# EasyEDA schematic ReA4091_Rev4_2023-05-15_SCH.json

## Sheets
1 Overview: REV: Commodore; Capture By: DATE
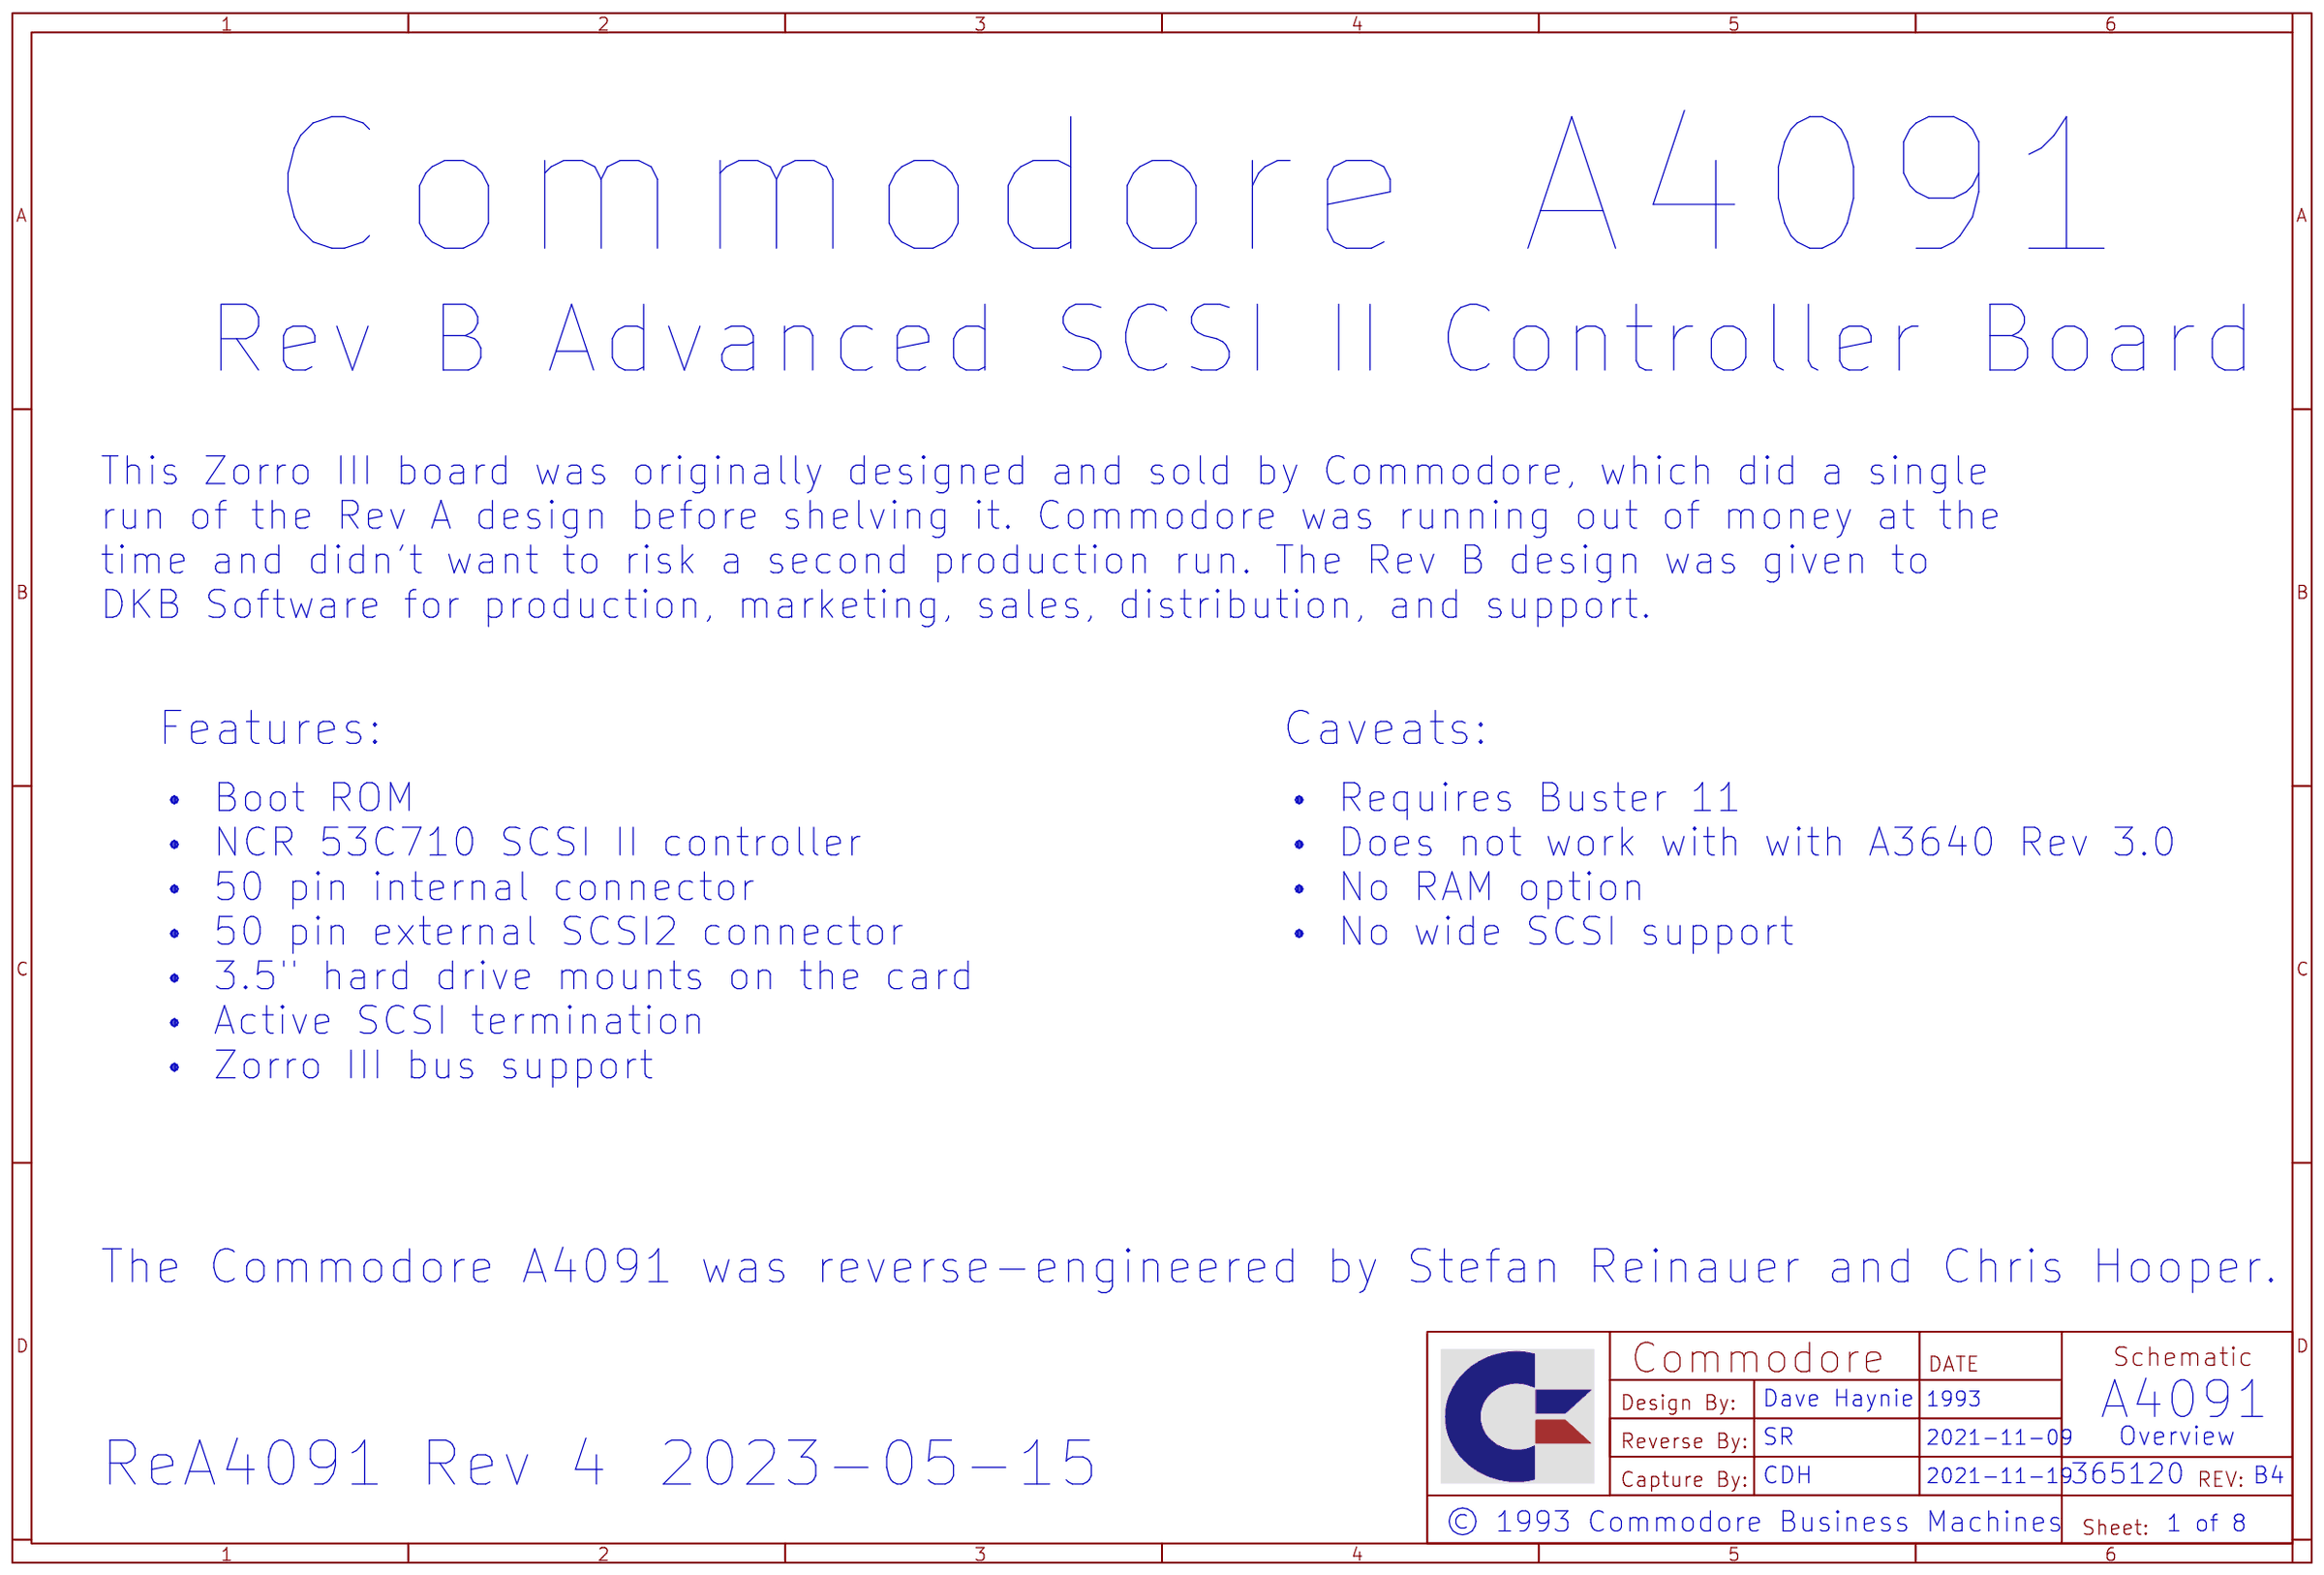
[diagram p0: Overview]
2 SCSI
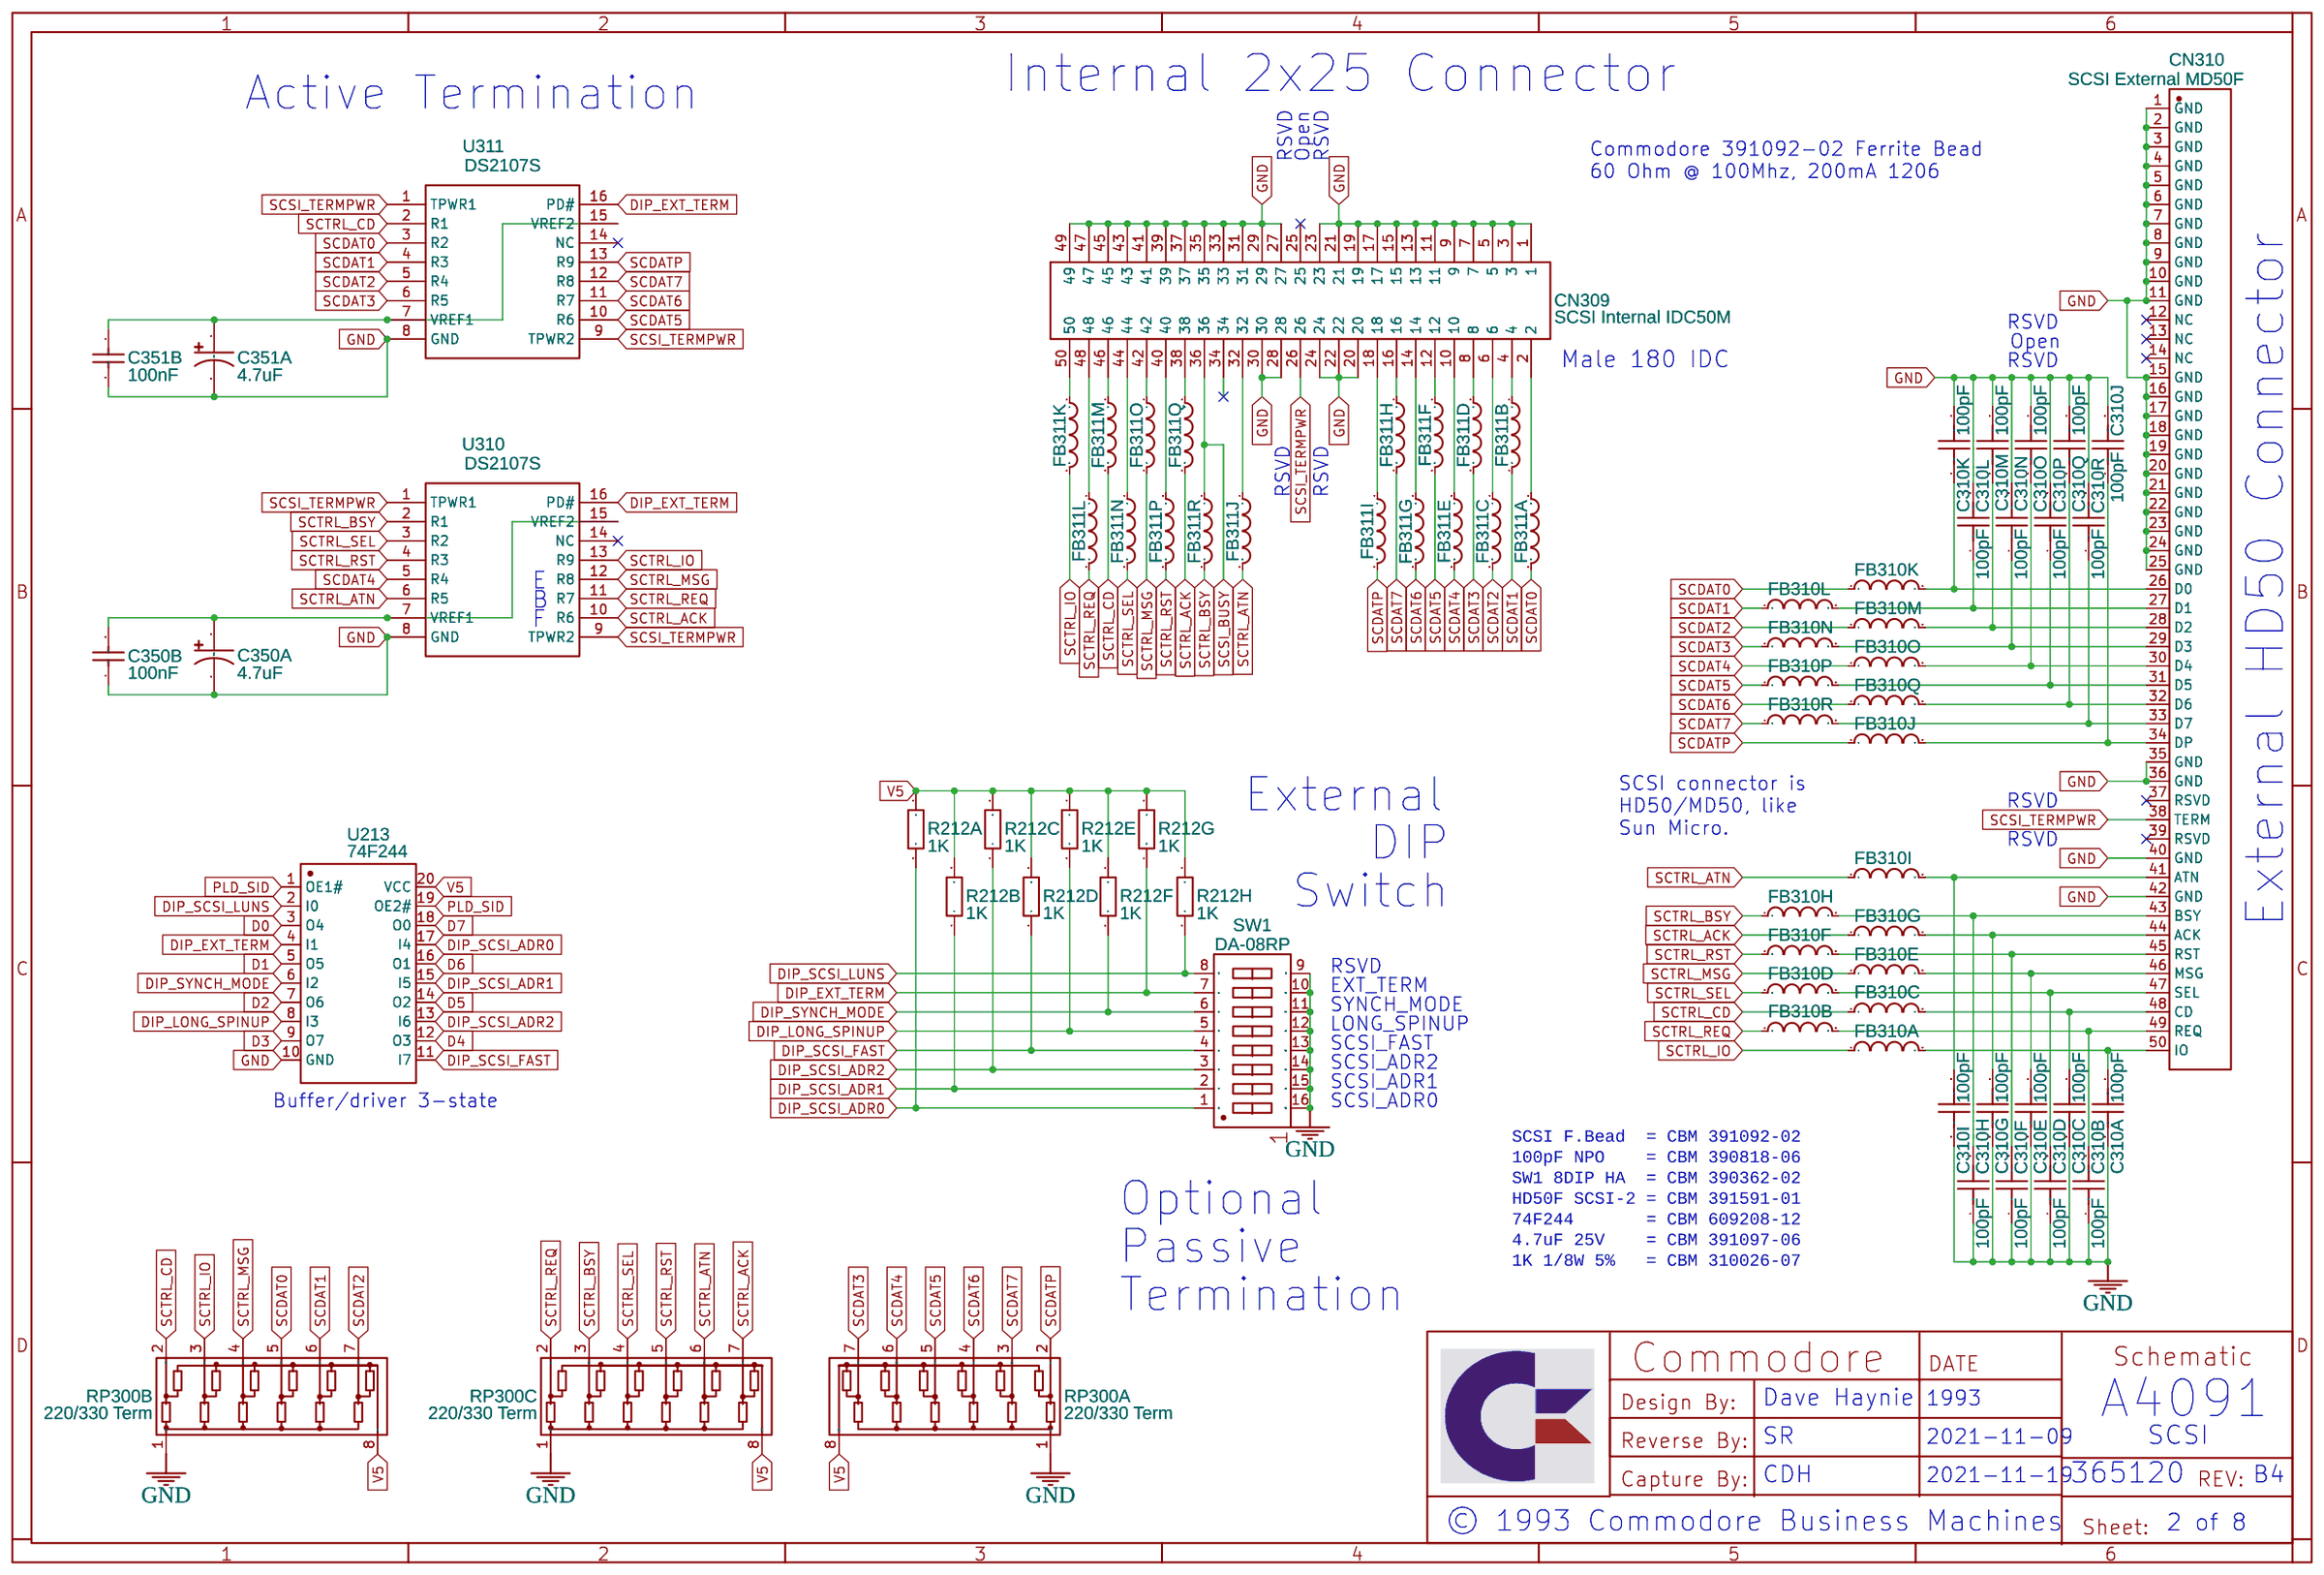
[diagram p1: SCSI]
3 NCR53C710
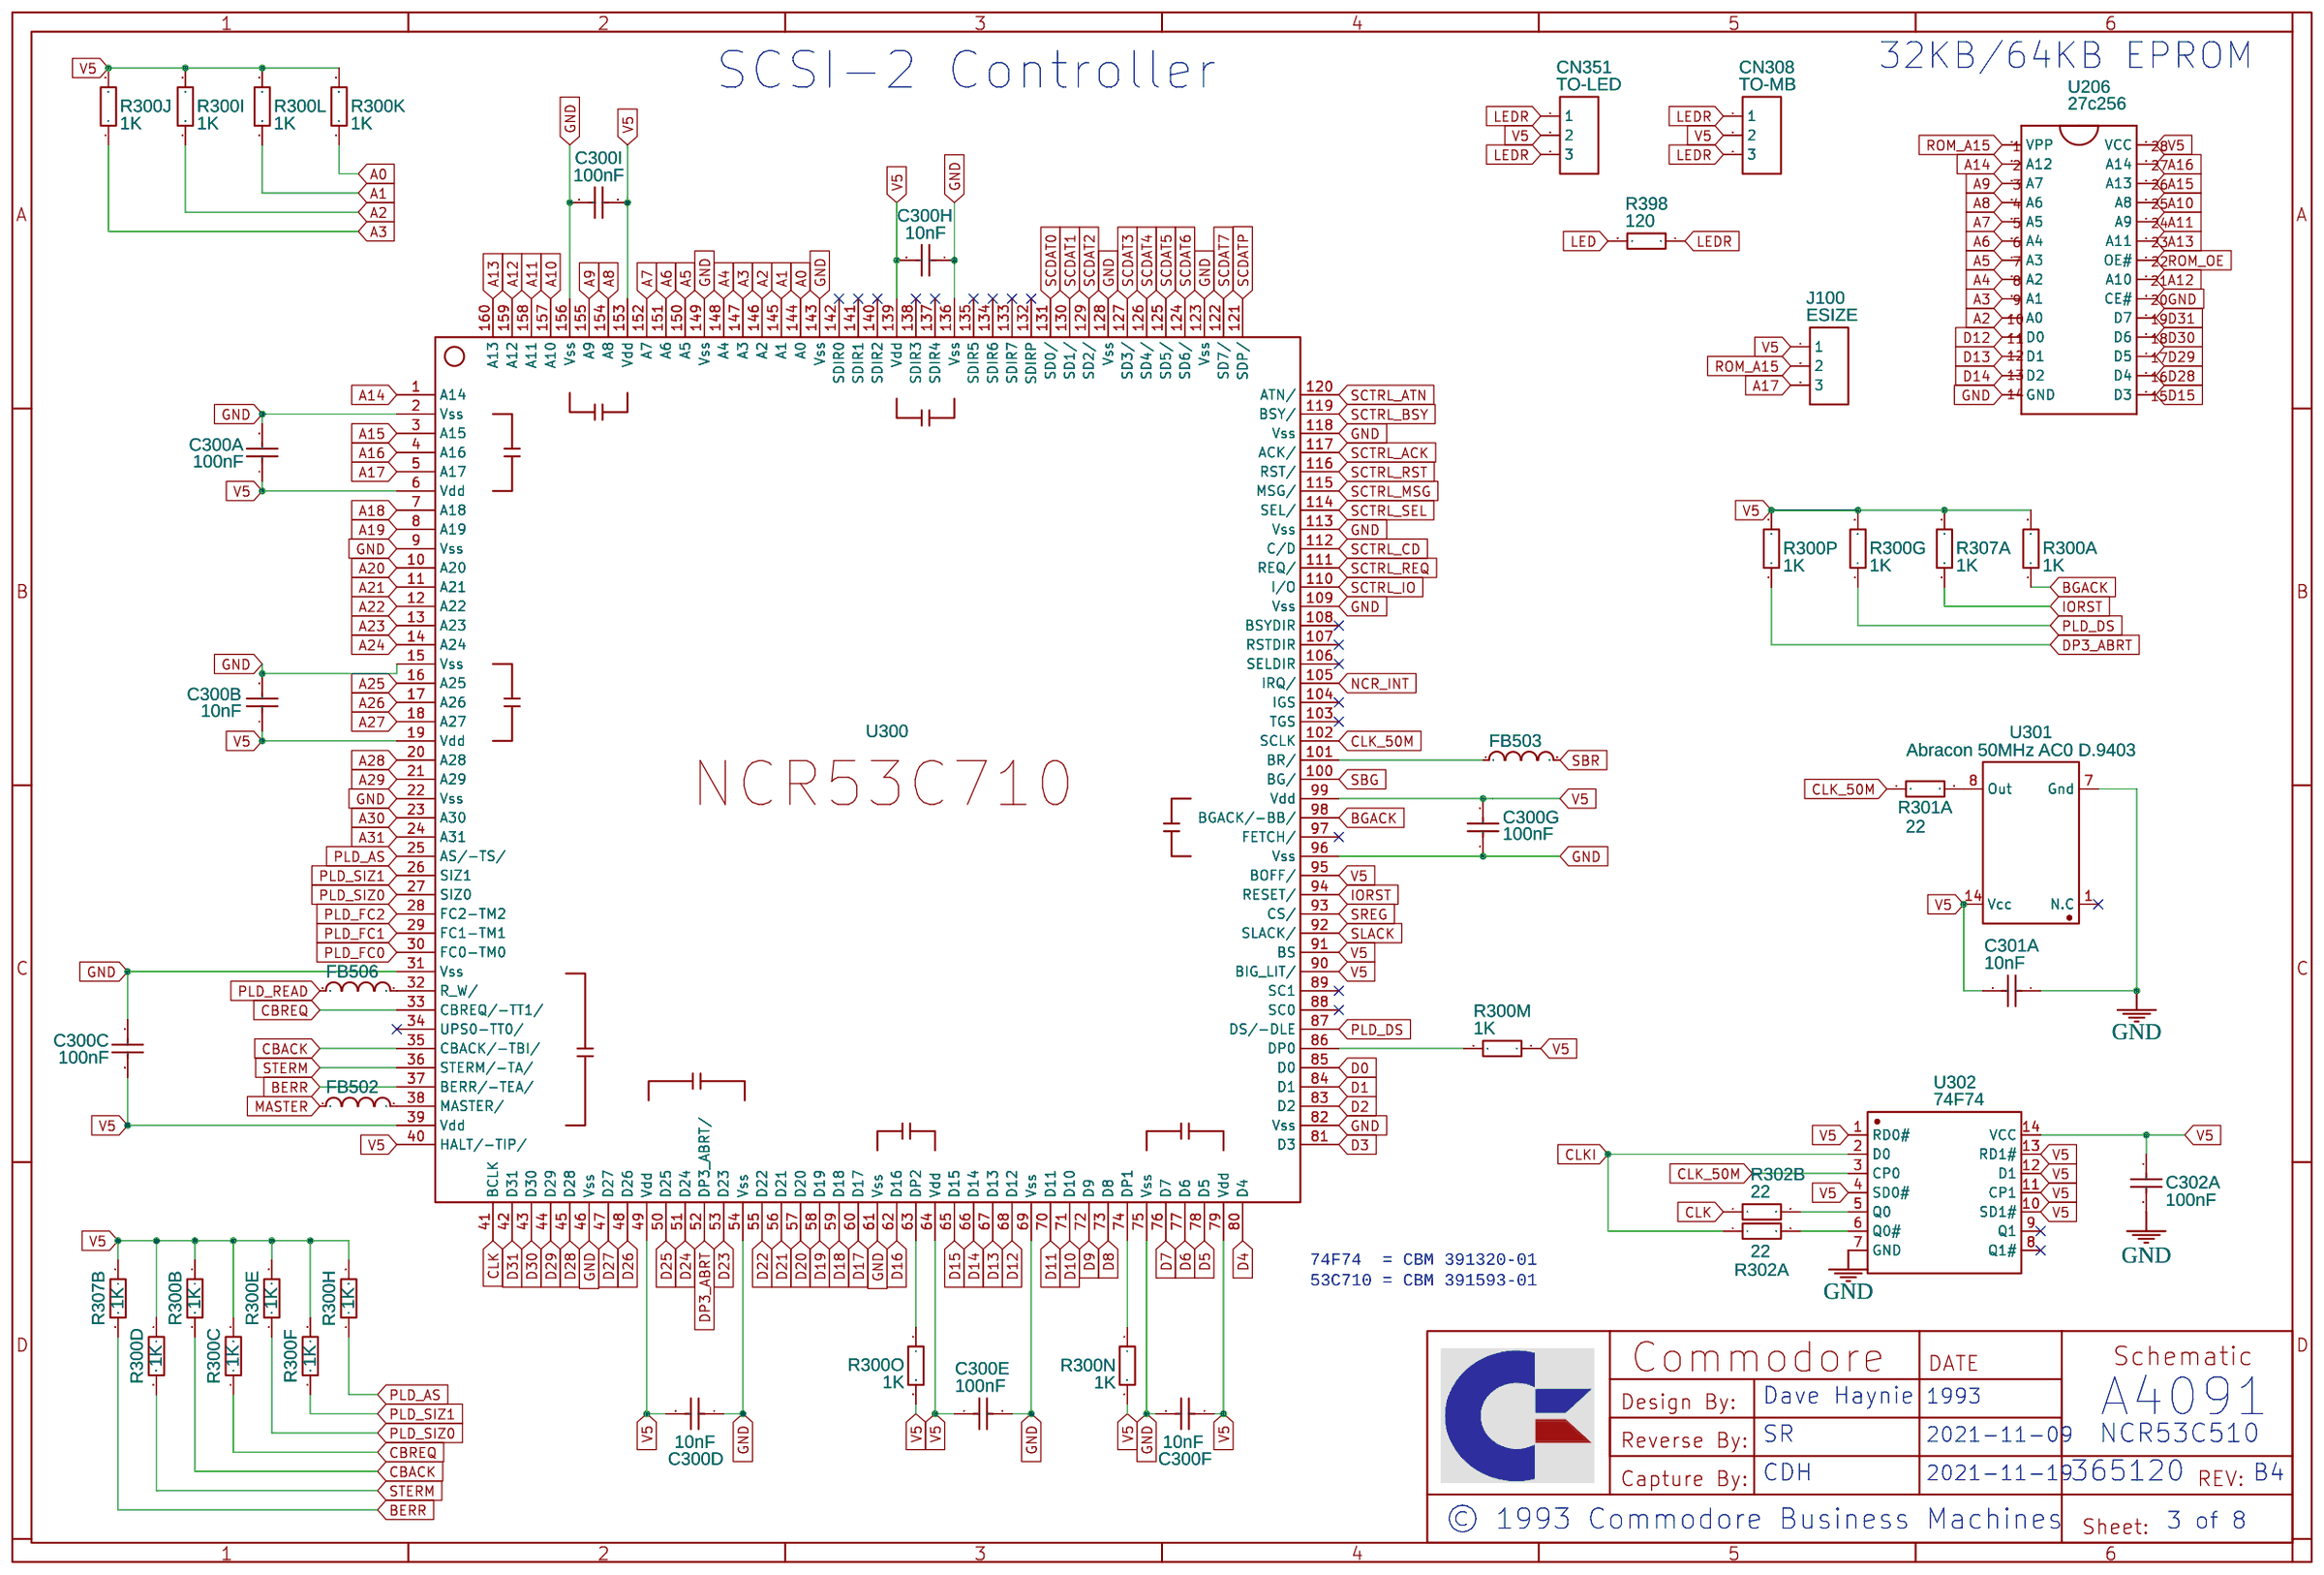
[diagram p2: NCR53C710]
4 PLD Symbols
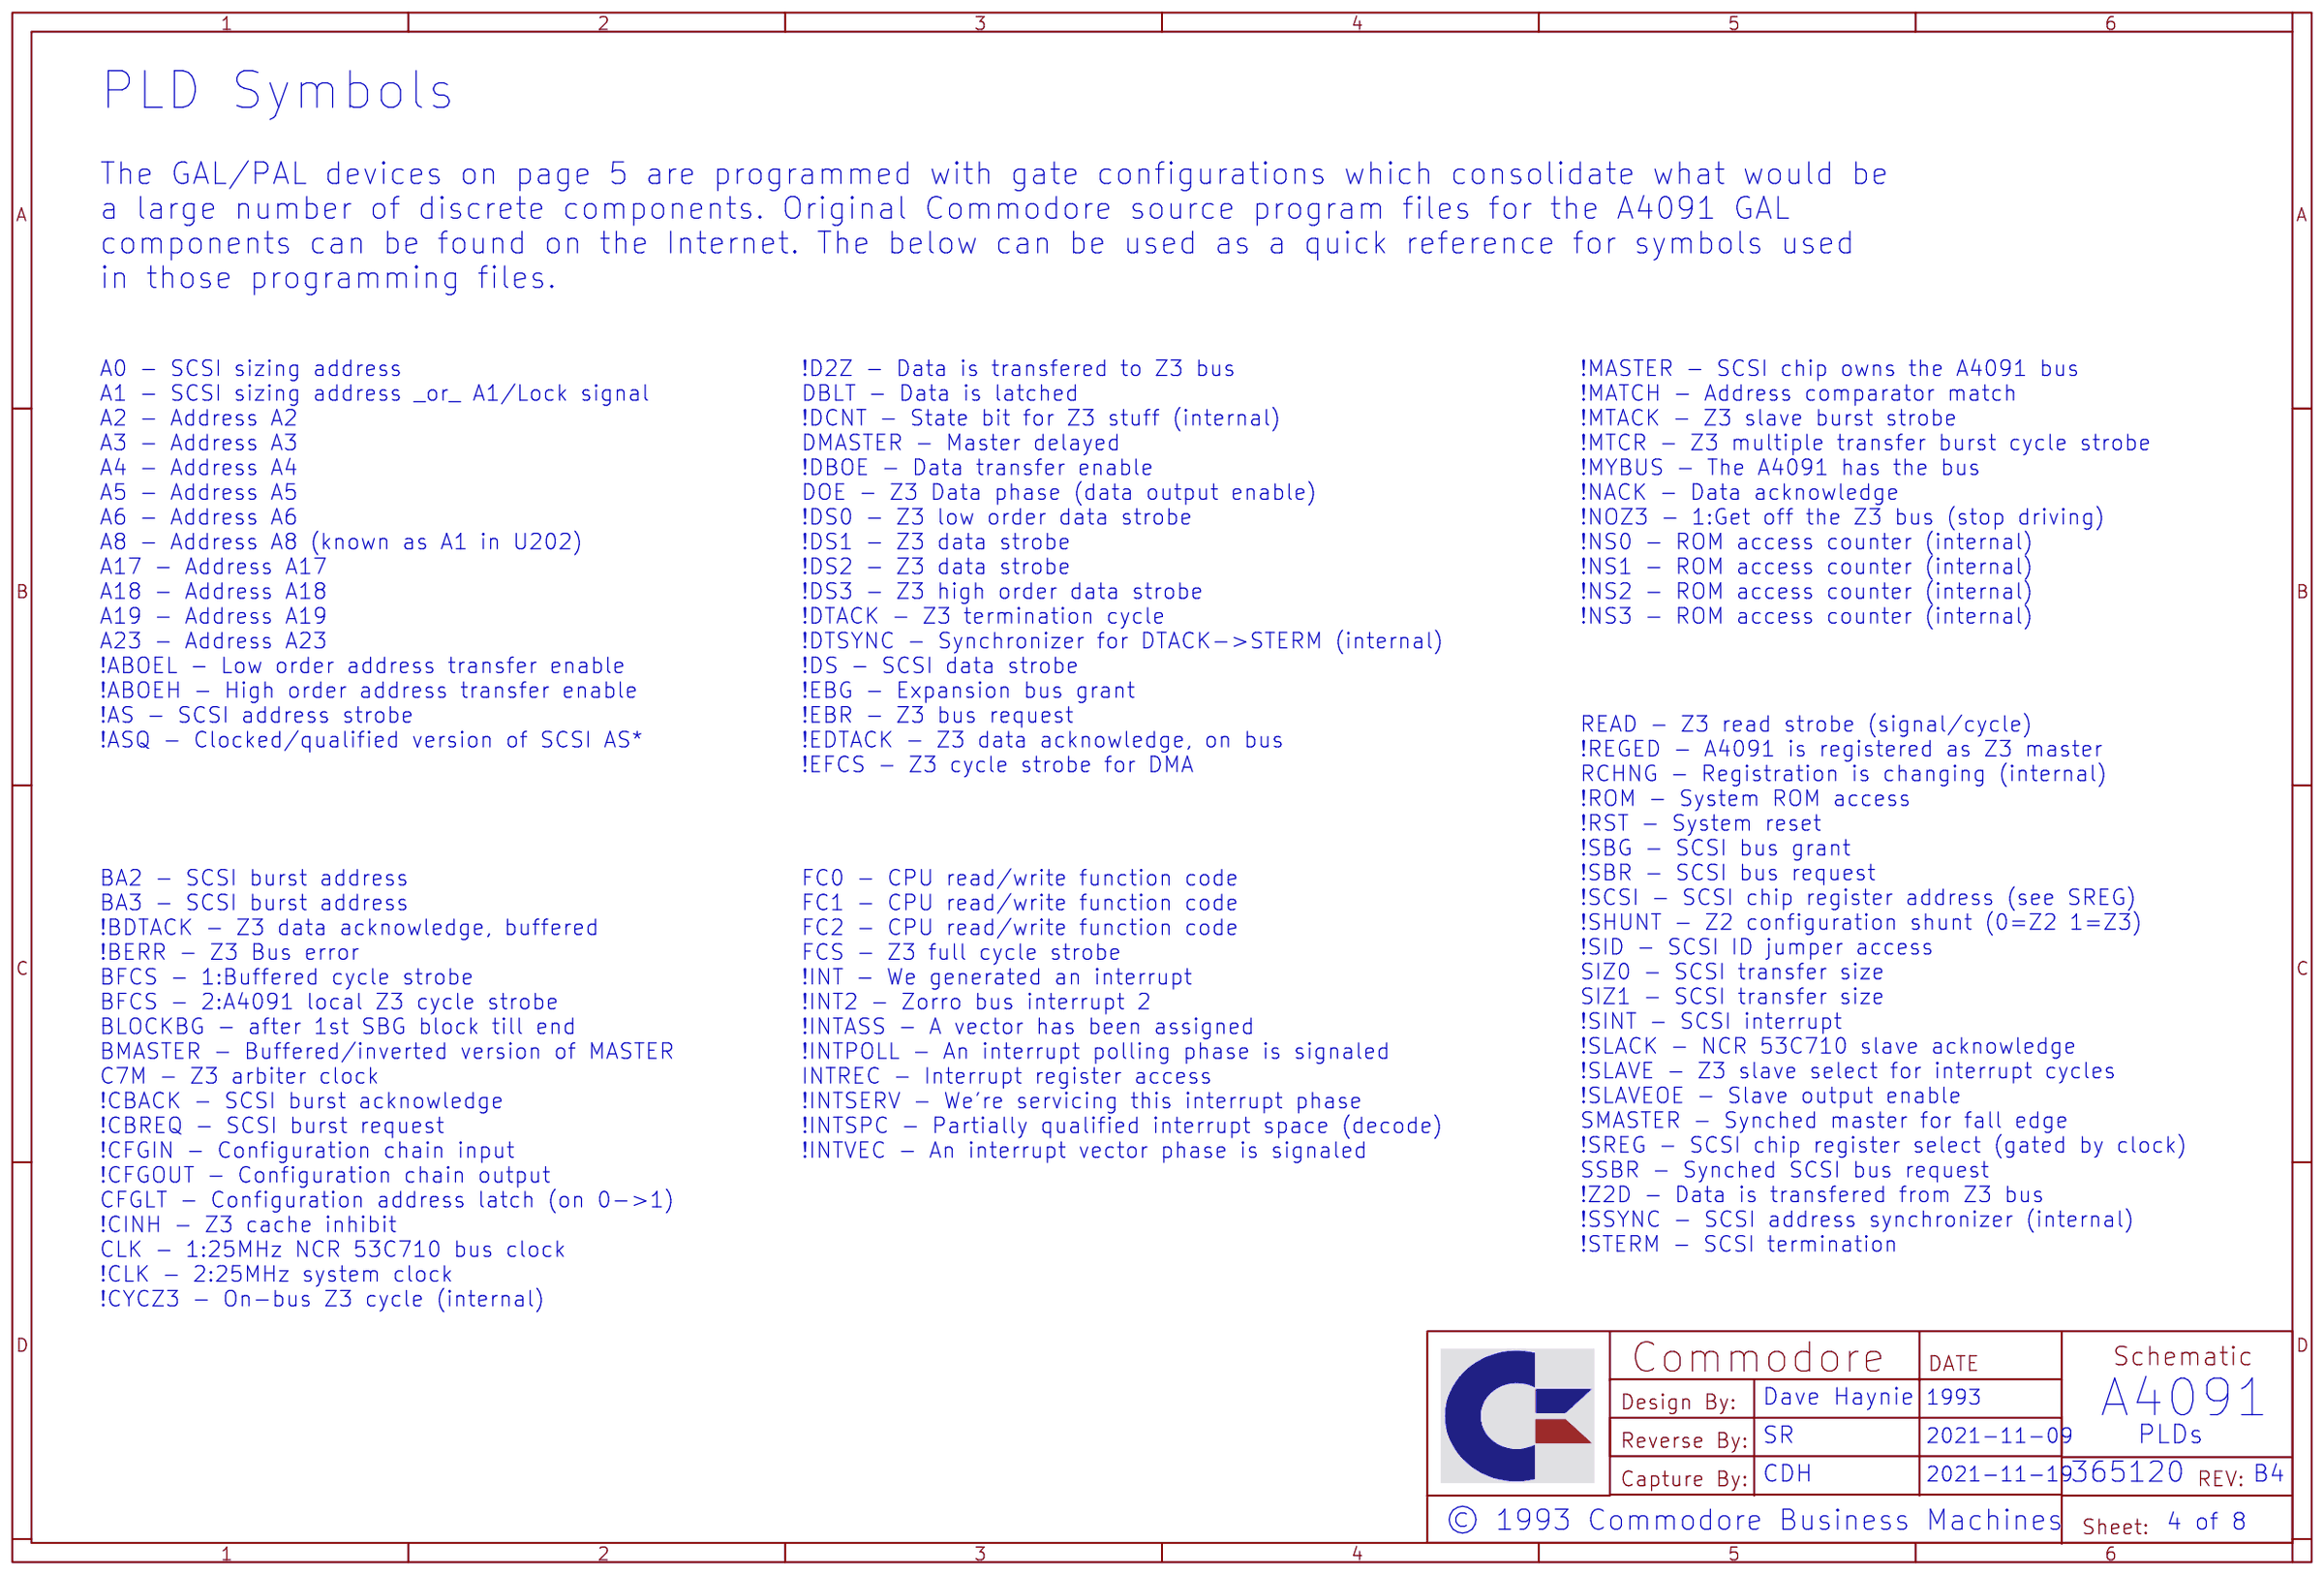
[diagram p3: PLD Symbols]
5 PLDs
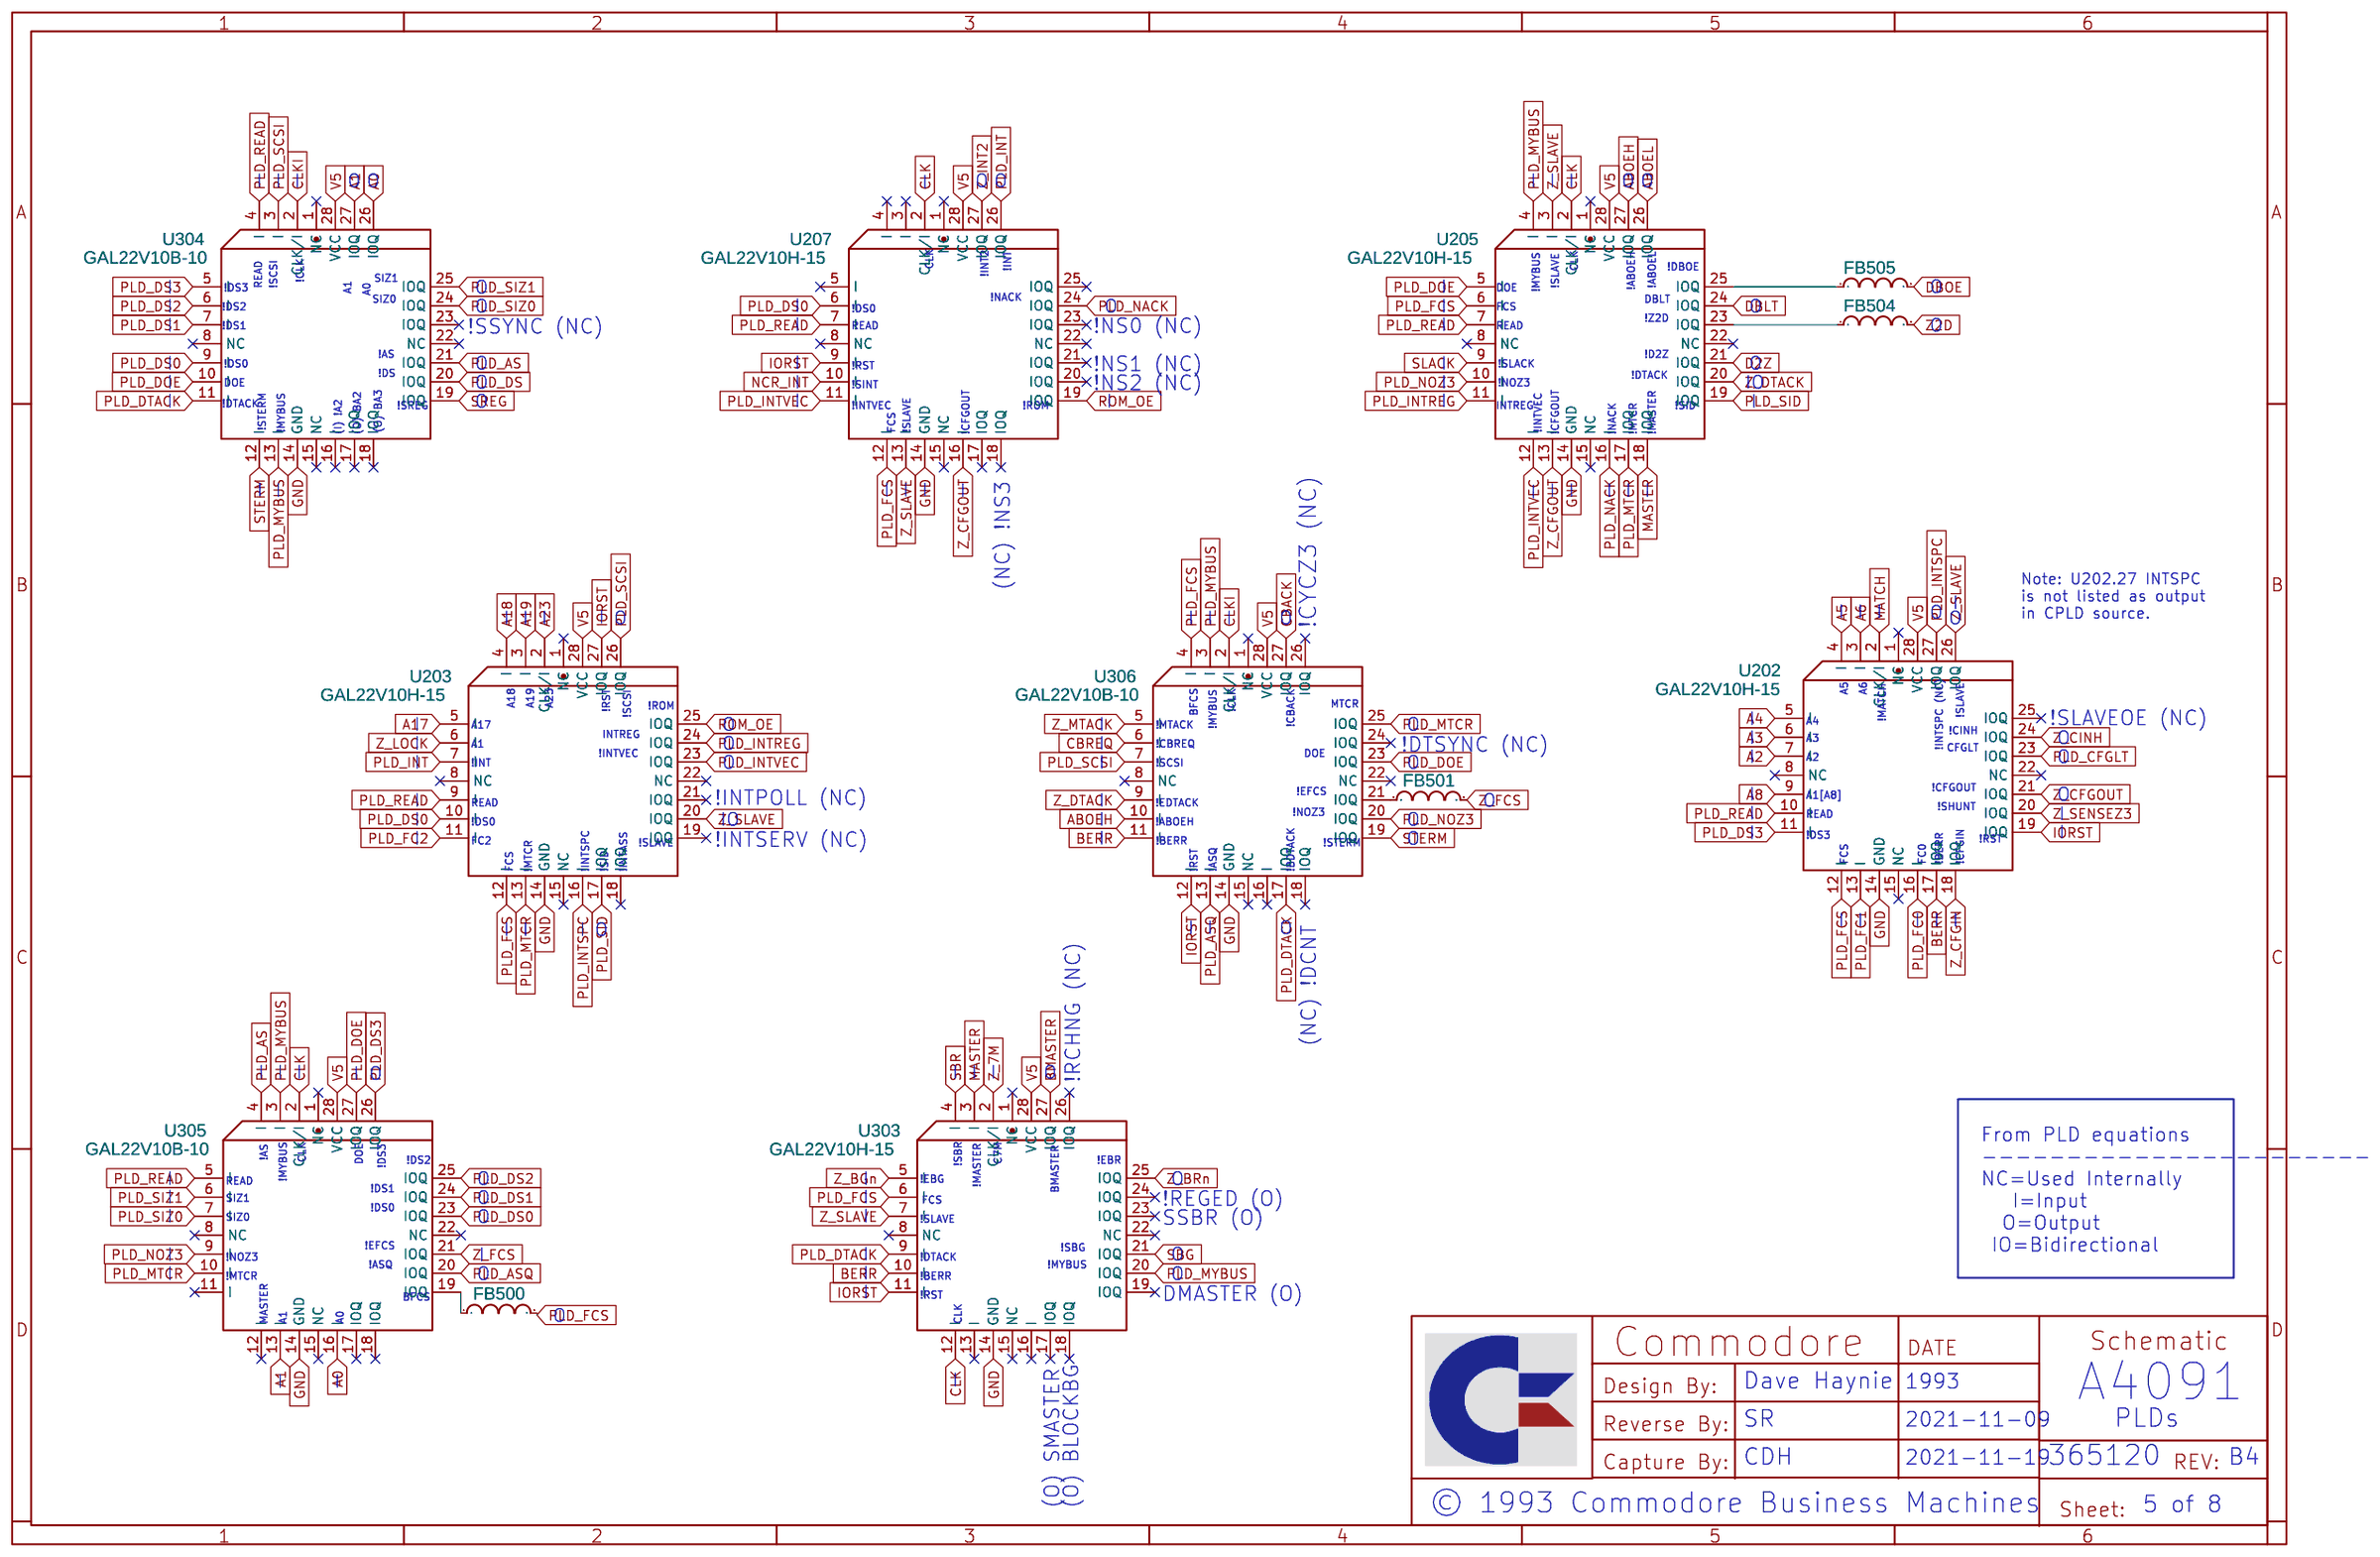
[diagram p4: PLDs]
6 Zorro
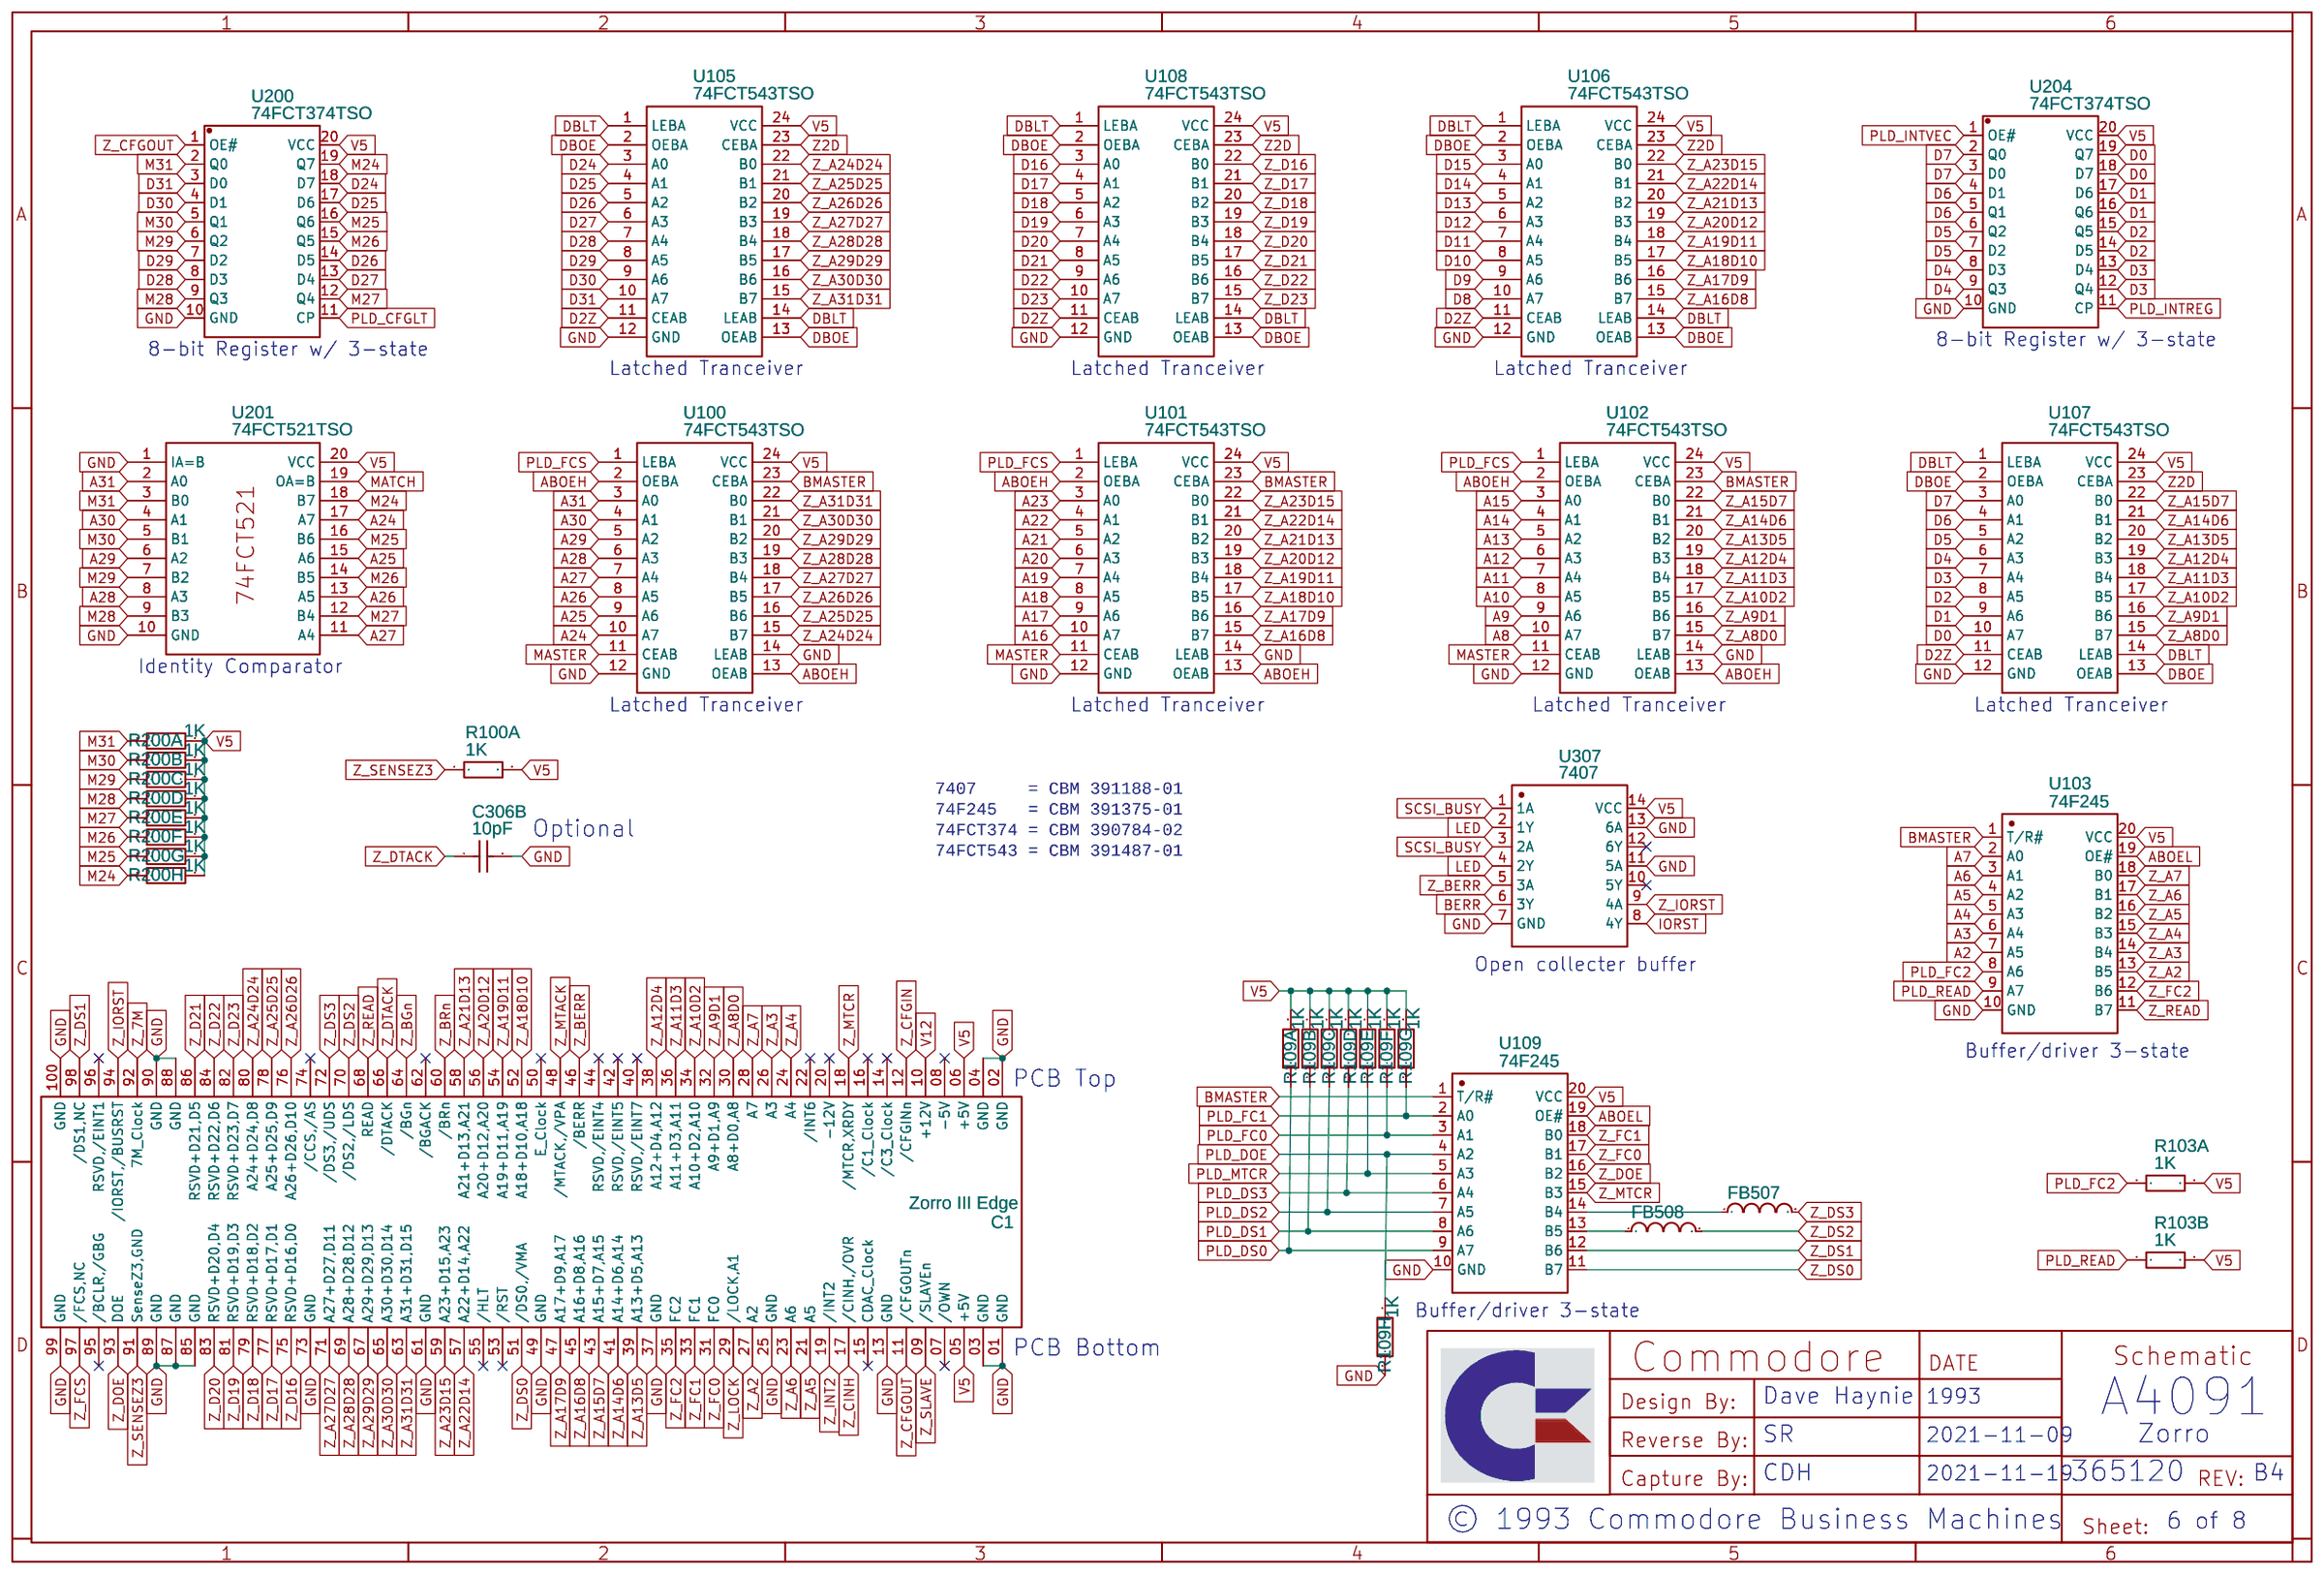
[diagram p5: Zorro]
7 Power
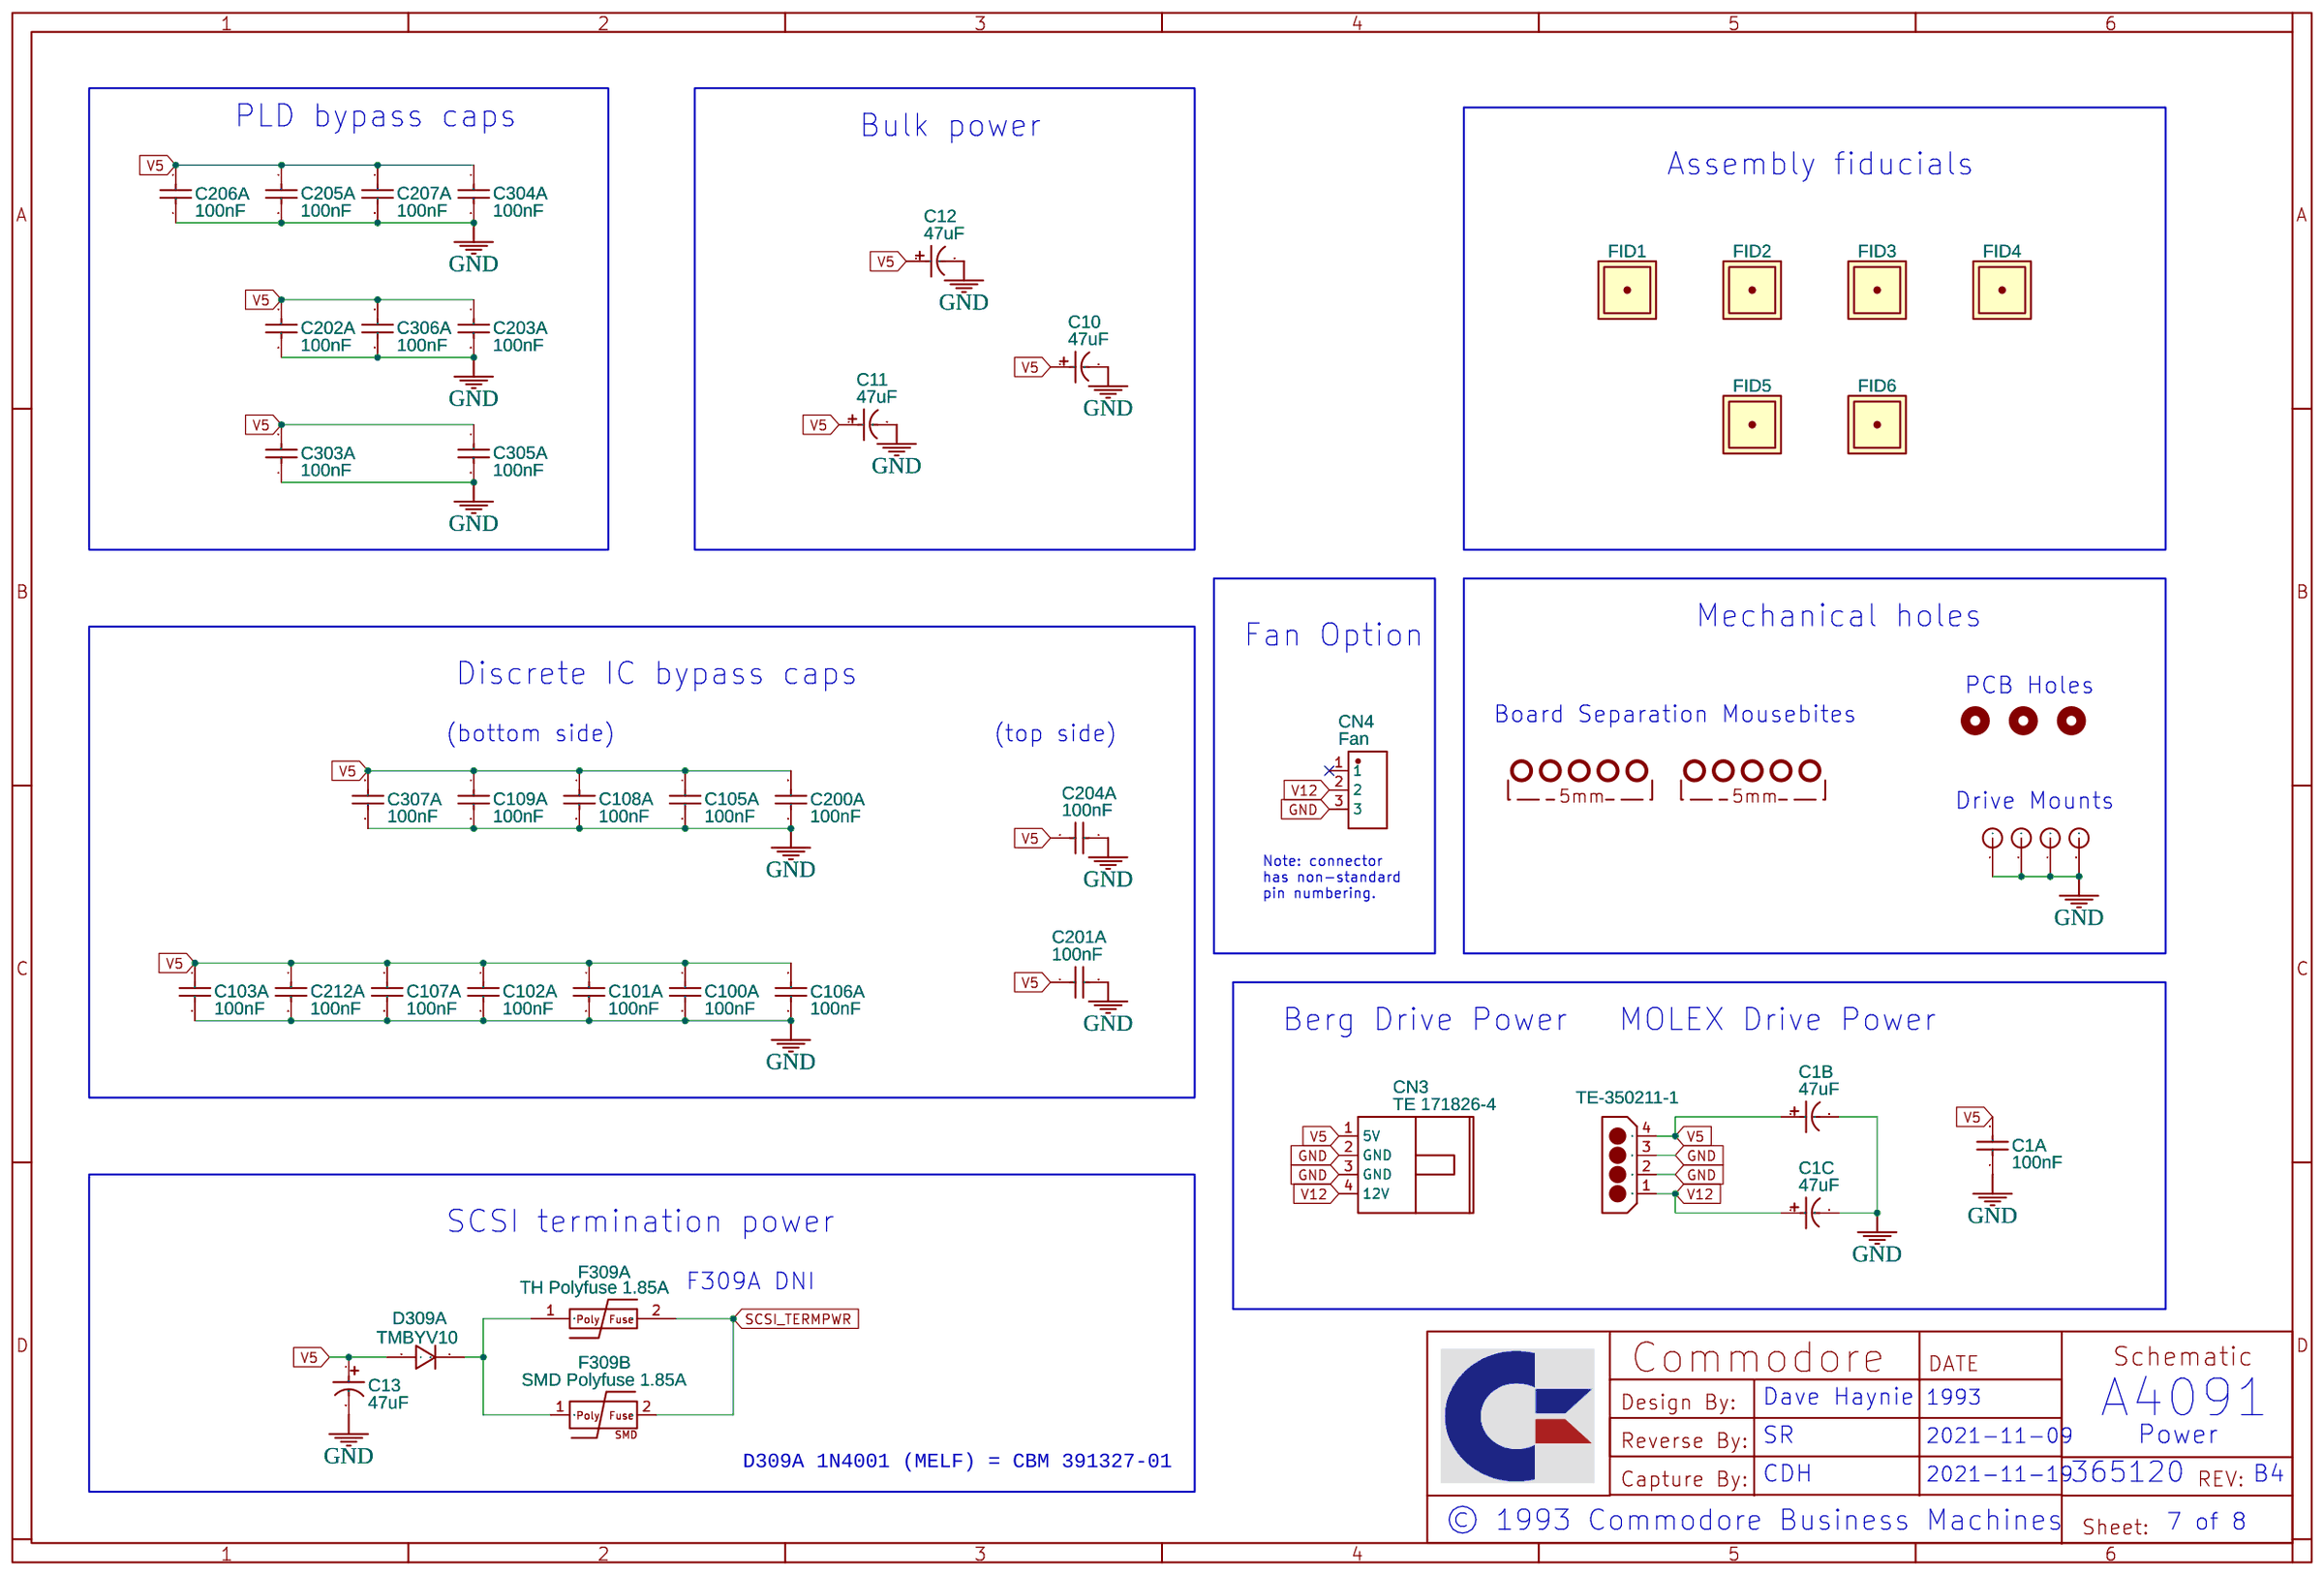
[diagram p6: Power]
8 SCSI Term
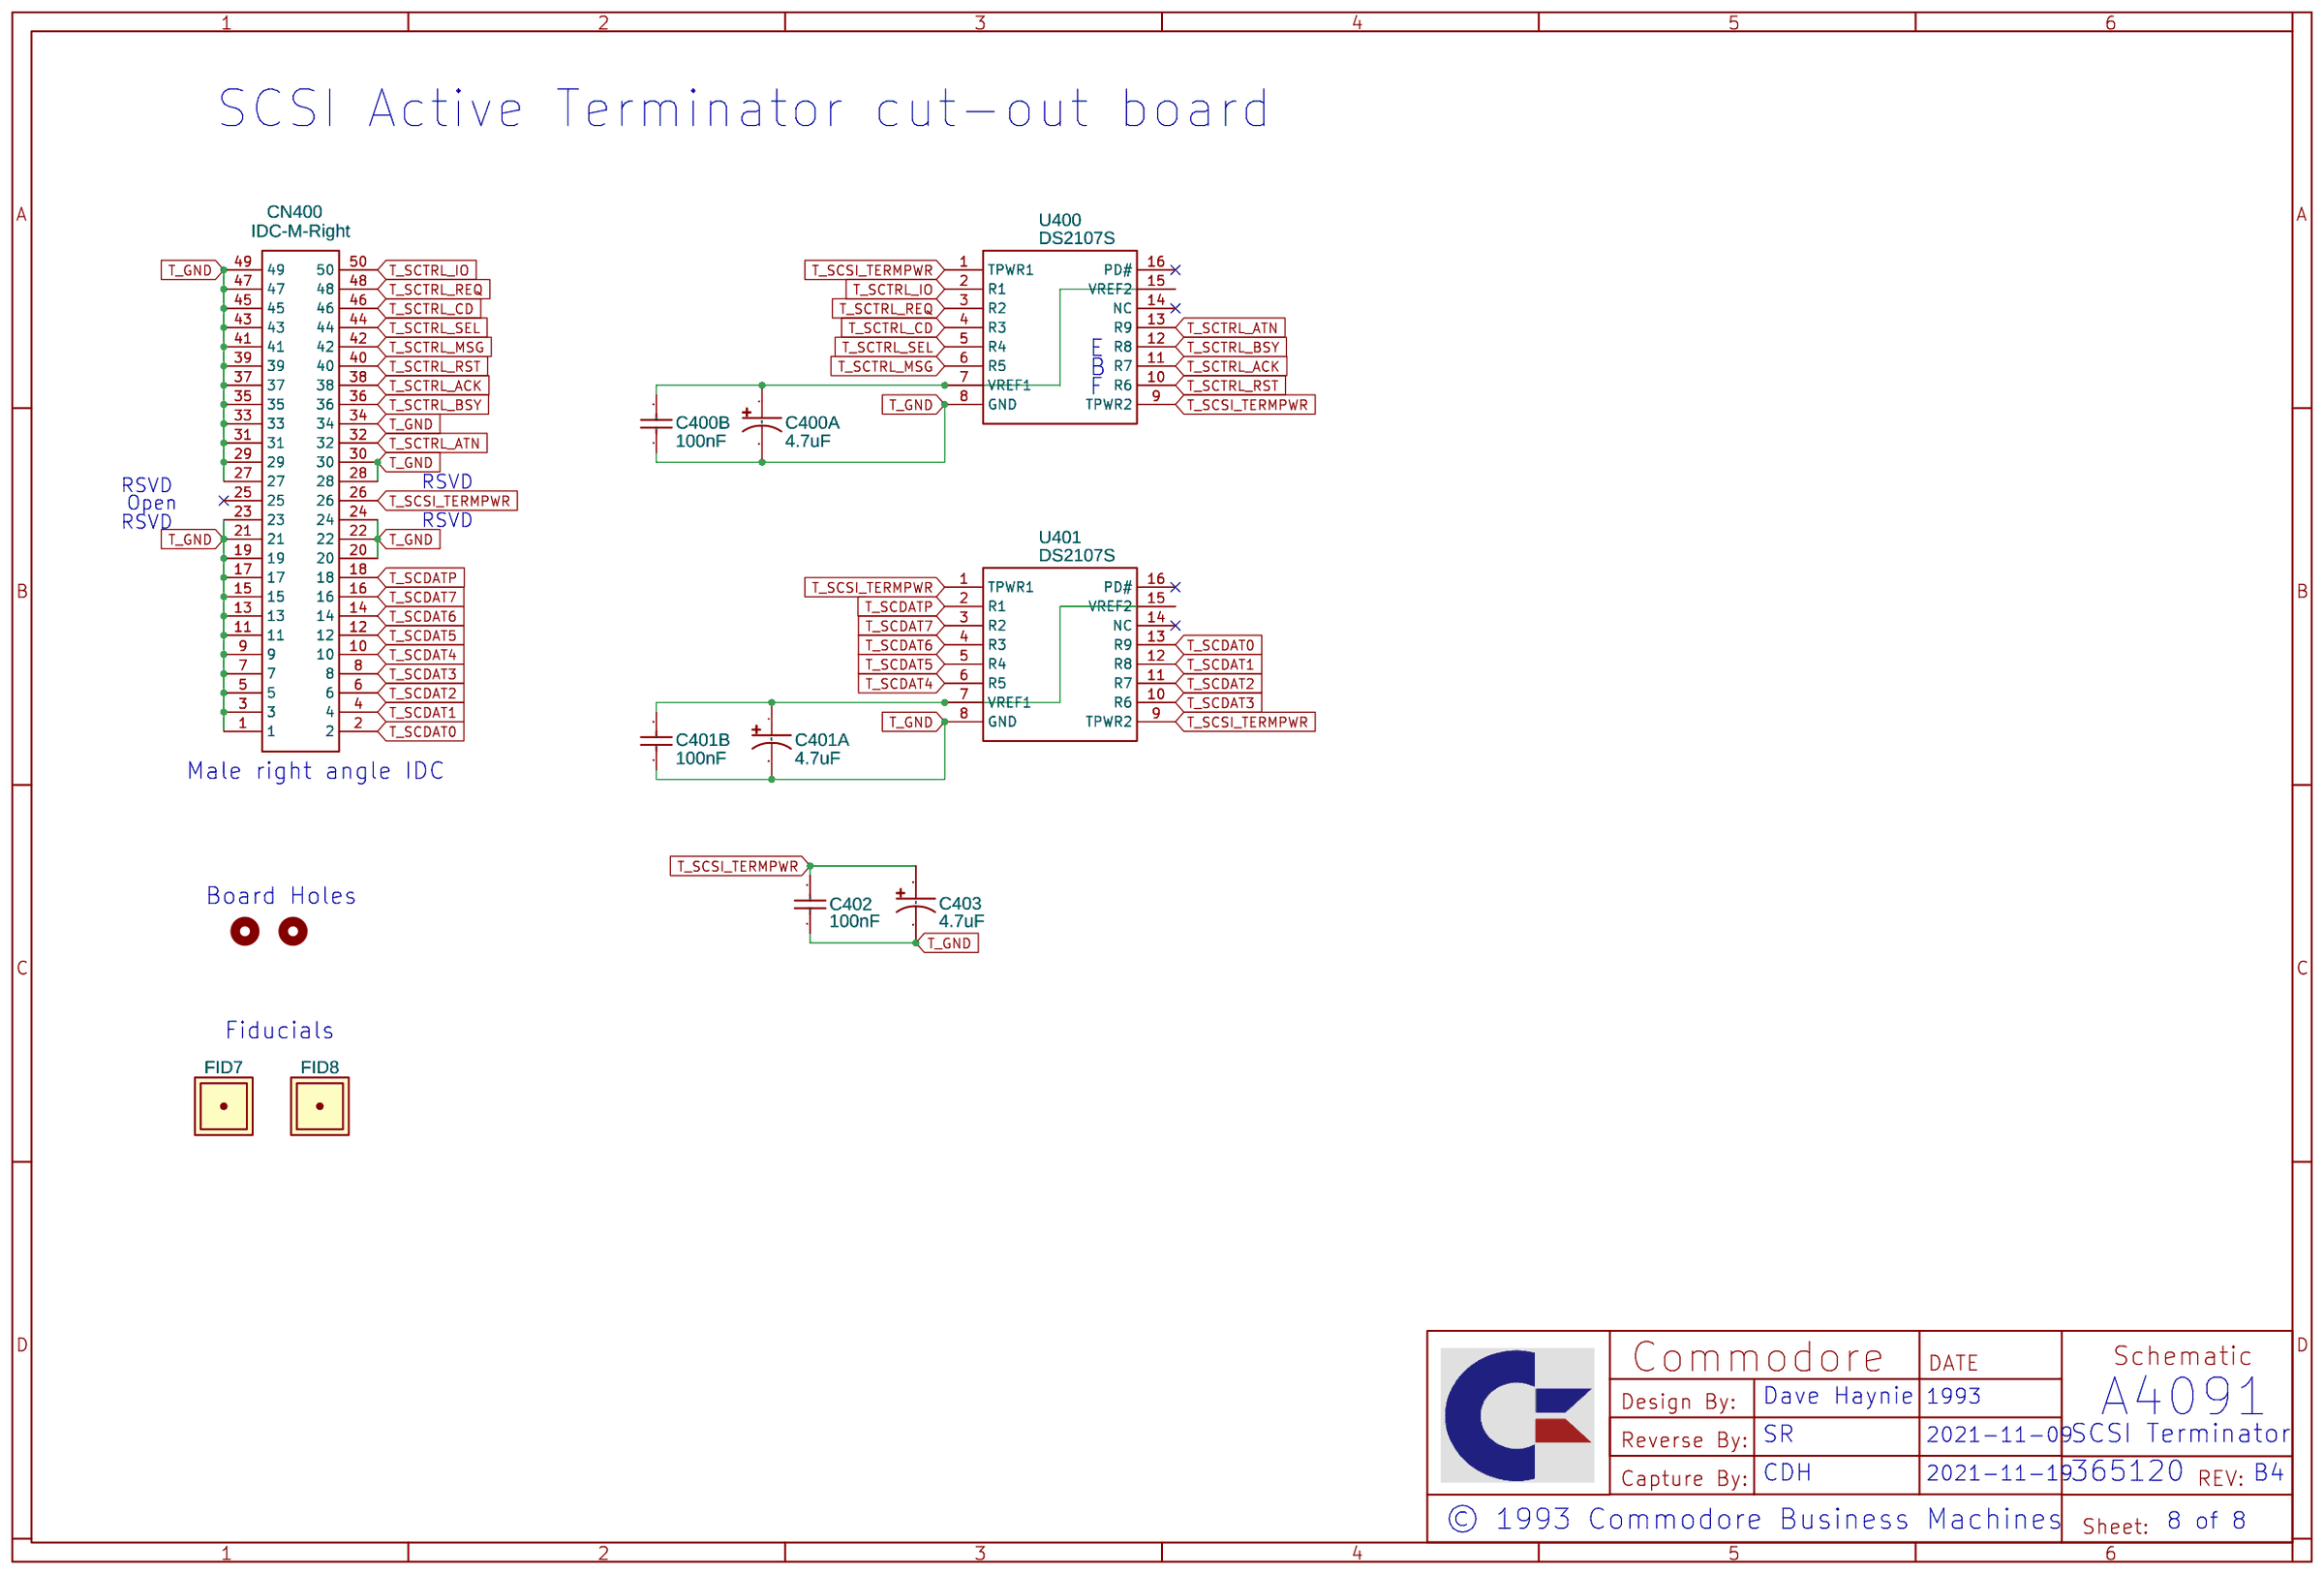
[diagram p7: SCSI Term]

## Parts
sheet NCR53C710
C300A  100nF  [C1206]
C300B  10nF  [C1206]
C300C  100nF  [C1206]
C300D  10nF  [C1206]
C300E  100nF  [C1206]
C300F  10nF  [C1206]
C300G  100nF  [C1206]
C300H  10nF  [C1206]
C300I  100nF  [C1206]
C301A  10nF  [C1206]
C302A  100nF  [C1206]
CN308  TO-MB  [HDR-TH_3P-P2.54-V-M-1]
CN351  TO-LED  [HDR-TH_3P-P2.54-V-M-1]
FB502  60Ω  [L1206]
FB503  60Ω  [L1206]
FB506  60Ω  [L1206]
J100  ESIZE  [HDR-TH_3P-P2.54-V-M-1]
R300A  1K  [C1206]
R300B  1K  [C1206]
R300C  1K  [C1206]
R300D  1K  [C1206]
R300E  1K  [C1206]
R300F  1K  [C1206]
R300G  1K  [C1206]
R300H  1K  [C1206]
R300I  1K  [C1206]
R300J  1K  [C1206]
R300K  1K  [C1206]
R300L  1K  [C1206]
R300M  1K  [C1206]
R300N  1K  [C1206]
R300O  1K  [C1206]
R300P  1K  [C1206]
R301A  22  [C1206]
R302A  22  [C1206]
R302B  22  [C1206]
R307A  1K  [C1206]
R307B  1K  [C1206]
R398  120  [C1206]
U206  27c256  [DIP-28W]
U300  NCR53C710  [PQFP-160-PASTE]
U301  Abracon 50MHz AC0 D.9403  [OSC-TH_4P-L20.4-W12.8-P15.24-BL]
U302  74F74  [SOIC-14_L8.7-W3.9-P1.27-LS6.0-BL]
sheet PLDs
FB500  60Ω  [L1206]
FB501  60Ω  [L1206]
FB504  60Ω  [L1206]
FB505  60Ω  [L1206]
U202  GAL22V10H-15  [PLCC-28_TOP_L11.5-W11.5-P1.27-LS12.5-L_HOLES]
U203  GAL22V10H-15  [PLCC-28_TOP_L11.5-W11.5-P1.27-LS12.5-L_HOLES]
U205  GAL22V10H-15  [PLCC-28_TOP_L11.5-W11.5-P1.27-LS12.5-L_HOLES]
U207  GAL22V10H-15  [PLCC-28_TOP_L11.5-W11.5-P1.27-LS12.5-L_HOLES]
U303  GAL22V10H-15  [PLCC-28_TOP_L11.5-W11.5-P1.27-LS12.5-L_HOLES]
U304  GAL22V10B-10  [PLCC-28_TOP_L11.5-W11.5-P1.27-LS12.5-L_HOLES]
U305  GAL22V10B-10  [PLCC-28_TOP_L11.5-W11.5-P1.27-LS12.5-L_HOLES]
U306  GAL22V10B-10  [PLCC-28_TOP_L11.5-W11.5-P1.27-LS12.5-L_HOLES]
sheet Power
C1A  100nF  [C1206]
C1B  47uF  [CAP-SMD_BD6.3-L6.6-W6.6-FD_PASTE]
C1C  47uF  [CAP-SMD_BD6.3-L6.6-W6.6-FD_PASTE]
C10  47uF  [CAP-SMD_BD6.3-L6.6-W6.6-FD_PASTE]
C11  47uF  [CAP-SMD_BD6.3-L6.6-W6.6-FD_PASTE]
C12  47uF  [CAP-SMD_BD6.3-L6.6-W6.6-FD_PASTE]
C13  47uF  [CAP-SMD_BD6.3-L6.6-W6.6-FD_PASTE]
C100A  100nF  [C1206]
C101A  100nF  [C1206]
C102A  100nF  [C1206]
C103A  100nF  [C1206]
C105A  100nF  [C1206]
C106A  100nF  [C1206]
C107A  100nF  [C1206]
C108A  100nF  [C1206]
C109A  100nF  [C1206]
C200A  100nF  [C1206]
C201A  100nF  [C1206]
C202A  100nF  [C1206]
C203A  100nF  [C1206]
C204A  100nF  [C1206]
C205A  100nF  [C1206]
C206A  100nF  [C1206]
C207A  100nF  [C1206]
C212A  100nF  [C1206]
C303A  100nF  [C1206]
C304A  100nF  [C1206]
C305A  100nF  [C1206]
C306A  100nF  [C1206]
C307A  100nF  [C1206]
CN2  TE-350211-1  [TE-350211-1-SIMPLE]
CN3  TE 171826-4  [FLOPPY PWR]
CN4  Fan  [CONN-TH_KF2510-3AGW]
D309A  TMBYV10  [MELF_L5.0-W2.6-FD]
F309A  TH Polyfuse 1.85A  [FUSE-TH_BD3.1-L7.5-P25.00-D1.2]
F309B  SMD Polyfuse 1.85A  [FUSE-SMD-F2920]
FID1  FIDUCIAL_SQUARE_DOT_128_100  [FIDUCIAL_SQUARE_DOT_128_100]
FID2  FIDUCIAL_SQUARE_DOT_128_100  [FIDUCIAL_SQUARE_DOT_128_100]
FID3  FIDUCIAL_SQUARE_DOT_128_100  [FIDUCIAL_SQUARE_DOT_128_100]
FID4  FIDUCIAL_SQUARE_DOT_128_100  [FIDUCIAL_SQUARE_DOT_128_100]
FID5  FIDUCIAL_SQUARE_DOT_128_100  [FIDUCIAL_SQUARE_DOT_128_100]
FID6  FIDUCIAL_SQUARE_DOT_128_100  [FIDUCIAL_SQUARE_DOT_128_100]
MB1  Mousebites  [MOUSEBITES]
MB2  Mousebites  [MOUSEBITES]
MH1  MOUNTINGHOLE_4MM  [MOUNTINGHOLE_4MM_PAD]
MH2  MOUNTINGHOLE_4MM  [MOUNTINGHOLE_4MM_PAD]
MH3  MOUNTINGHOLE_4MM  [MOUNTINGHOLE_4MM_PAD]
MH4  MOUNTINGHOLE_4MM  [MOUNTINGHOLE_4MM_PAD]
MK5  Mounting_Hole  [MOUNTINGHOLE_5MM]
MK6  Mounting_Hole  [MOUNTINGHOLE_5MM]
MK7  Mounting_Hole  [MOUNTINGHOLE_5MM]
sheet SCSI Term
C400A  4.7uF  [CAP-SMD_BD4.0-L4.3-W4.3-LS5.1-FD-PASTE]
C400B  100nF  [C1206]
C401A  4.7uF  [CAP-SMD_BD4.0-L4.3-W4.3-LS5.1-FD-PASTE]
C401B  100nF  [C1206]
C402  100nF  [C1206]
C403  4.7uF  [CAP-SMD_BD4.0-L4.3-W4.3-LS5.1-FD-PASTE]
CN400  IDC-M-Right  [IDC-TH_50P-P2.54_Z-231012050106_SMALL_SILK]
FID7  FIDUCIAL_SQUARE_DOT_128_100  [FIDUCIAL_SQUARE_DOT_128_100]
FID8  FIDUCIAL_SQUARE_DOT_128_100  [FIDUCIAL_SQUARE_DOT_128_100]
MK1  Mounting_Hole  [MOUNTINGHOLE_5MM]
MK2  Mounting_Hole  [MOUNTINGHOLE_5MM]
U400  DS2107S  [SOIC16E]
U401  DS2107S  [SOIC16E]
sheet SCSI
C310A  100pF  [C1206]
C310B  100pF  [C1206]
C310C  100pF  [C1206]
C310D  100pF  [C1206]
C310E  100pF  [C1206]
C310F  100pF  [C1206]
C310G  100pF  [C1206]
C310H  100pF  [C1206]
C310I  100pF  [C1206]
C310J  100pF  [C1206]
C310K  100pF  [C1206]
C310L  100pF  [C1206]
C310M  100pF  [C1206]
C310N  100pF  [C1206]
C310O  100pF  [C1206]
C310P  100pF  [C1206]
C310Q  100pF  [C1206]
C310R  100pF  [C1206]
C350A  4.7uF  [CAP-SMD_BD4.0-L4.3-W4.3-LS5.1-FD-PASTE]
C350B  100nF  [C1206]
C351A  4.7uF  [CAP-SMD_BD4.0-L4.3-W4.3-LS5.1-FD-PASTE]
C351B  100nF  [C1206]
CN309  SCSI Internal IDC50M  [IDC-TH_300S-50P]
CN310  SCSI External MD50F  [MD50 RIGHT ANGLE CONNECTOR]
FB310A  60Ω  [L1206]
FB310B  60Ω  [L1206]
FB310C  60Ω  [L1206]
FB310D  60Ω  [L1206]
FB310E  60Ω  [L1206]
FB310F  60Ω  [L1206]
FB310G  60Ω  [L1206]
FB310H  60Ω  [L1206]
FB310I  60Ω  [L1206]
FB310J  60Ω  [L1206]
FB310K  60Ω  [L1206]
FB310L  60Ω  [L1206]
FB310M  60Ω  [L1206]
FB310N  60Ω  [L1206]
FB310O  60Ω  [L1206]
FB310P  60Ω  [L1206]
FB310Q  60Ω  [L1206]
FB310R  60Ω  [L1206]
FB311A  60Ω  [L1206]
FB311B  60Ω  [L1206]
FB311C  60Ω  [L1206]
FB311D  60Ω  [L1206]
FB311E  60Ω  [L1206]
FB311F  60Ω  [L1206]
FB311G  60Ω  [L1206]
FB311H  60Ω  [L1206]
FB311I  60Ω  [L1206]
FB311J  60Ω  [L1206]
FB311K  60Ω  [L1206]
FB311L  60Ω  [L1206]
FB311M  60Ω  [L1206]
FB311N  60Ω  [L1206]
FB311O  60Ω  [L1206]
FB311P  60Ω  [L1206]
FB311Q  60Ω  [L1206]
FB311R  60Ω  [L1206]
R212A  1K  [C1206]
R212B  1K  [C1206]
R212C  1K  [C1206]
R212D  1K  [C1206]
R212E  1K  [C1206]
R212F  1K  [C1206]
R212G  1K  [C1206]
R212H  1K  [C1206]
RP300A  220/330 Term  [R_ARRAY_SIP8]
RP300B  220/330 Term  [R_ARRAY_SIP8]
RP300C  220/330 Term  [R_ARRAY_SIP8]
SW1  DA-08RP  [SW-TH_DA-08]
U213  74F244  [SOIC-20_L13.0-W7.6-P1.27-LS10.3-BL]
U310  DS2107S  [SOIC16E]
U311  DS2107S  [SOIC16E]
sheet Zorro
C1  Zorro III Edge  [ZORRO III EDGE]
C306B  10pF  [C0805]
FB507  60Ω  [L1206]
FB508  60Ω  [L1206]
R100A  1K  [C1206]
R103A  1K  [C1206]
R103B  1K  [C1206]
R109A  1K  [C1206]
R109B  1K  [C1206]
R109C  1K  [C1206]
R109D  1K  [C1206]
R109E  1K  [C1206]
R109F  1K  [C1206]
R109G  1K  [C1206]
R109H  1K  [C1206]
R200A  1K  [C1206]
R200B  1K  [C1206]
R200C  1K  [C1206]
R200D  1K  [C1206]
R200E  1K  [C1206]
R200F  1K  [C1206]
R200G  1K  [C1206]
R200H  1K  [C1206]
U100  74FCT543TSO  [SOIC24E]
U101  74FCT543TSO  [SOIC24E]
U102  74FCT543TSO  [SOIC24E]
U103  74F245  [SOIC-20_L13.0-W7.6-P1.27-LS10.3-BL]
U105  74FCT543TSO  [SOIC24E]
U106  74FCT543TSO  [SOIC24E]
U107  74FCT543TSO  [SOIC24E]
U108  74FCT543TSO  [SOIC24E]
U109  74F245  [SOIC-20_L13.0-W7.6-P1.27-LS10.3-BL]
U200  74FCT374TSO  [SOIC-20_L13.0-W7.6-P1.27-LS10.3-BL]
U201  74FCT521TSO  [SOIC-20_L13.0-W7.6-P1.27-LS10.3-BL]
U204  74FCT374TSO  [SOIC-20_L13.0-W7.6-P1.27-LS10.3-BL]
U307  7407  [SOIC-14_L8.7-W3.9-P1.27-LS6.0-BL]

## Library data of the parts
C1A C100A C101A C102A C103A C105A C106A C107A C108A C109A C200A C201A C202A C203A C204A C205A C206A C207A C212A C300A C300C C300E C300G C300I C302A C303A C304A C305A C306A C307A C350B C351B C400B C401B C402 = CL31B104KBCNNNC: Supplier: LCSC; Manufacturer: SAMSUNG; Supplier Part: C24497; JLCPCB Part Class: Basic Part
C300B C300D C300F C300H C301A = 1206B103K500NT: Supplier: LCSC; Manufacturer: FH; Supplier Part: C1846; JLCPCB Part Class: Basic Part
CN308 CN351 J100 = Header-Male-2.54_1x3: Supplier: LCSC; Manufacturer: BOOMELE; Manufacturer Part: Header2.54mm 1*3P; Supplier Part: C49257; JLCPCB Part Class: Extended Part
FB500-FB508 = MLB3216-601(f): Supplier: LCSC; Manufacturer: FH; Manufacturer Part: CBG321609U600T; Supplier Part: C1020; JLCPCB Part Class: Extended Part
R100A R103A R103B R109A R109B R109C R109D R109E R109F R109G R109H R200A R200B R200C R200D R200E R200F R200G R200H R212A R212B R212C R212D R212E R212F R212G R212H R300A R300B R300C R300D R300E R300F R300G R300H R300I R300J R300K R300L R300M R300N R300O R300P R307A R307B = 1206W4F1001T5E: Supplier: LCSC; Manufacturer: UniOhm; Supplier Part: C4410; JLCPCB Part Class: Basic Part
R301A R302A R302B = RS-06K22R0FT: Supplier: LCSC; Manufacturer: UNI-ROYAL(厚声); Manufacturer Part: 1206W4F220JT5E; Contributor: LCSC; Supplier Part: C17958; JLCPCB Part Class: Basic Part
R398 = RTT061200FTP: Supplier: LCSC; Manufacturer: UNI-ROYAL(厚声); Manufacturer Part: 1206W4F1200T5E; Contributor: LCSC; Supplier Part: C17909; JLCPCB Part Class: Extended Part
U206 = 27c256: Manufacturer: XFCN(兴飞); Manufacturer Part: IC254V-12-28-0743-P1524; Supplier Part: C2874016; Supplier: LCSC; Contributor: cdhooper
U300 = NCR53C710: Contributor: cdhooper
U301 = Osc: Supplier Part: C1138655; Supplier: LCSC; Contributor: tcollings; Manufacturer Part: MXO45T-3C-50M000000; Package Display: No; Manufacturer: CTS(西迪斯)
U302 = 74F74D: Supplier: LCSC; Manufacturer: PHILIPS; Supplier Part: C5573; Supplier Part Alt: C6805
U202 U203 U205 U207 U303-U306 = GAL22V10: Manufacturer: Lattice; Manufacturer Part: GAL220V10; Contributor: cdhooper
C1B C1C C10 C12 C13 = RVT1V470M0605: Supplier: LCSC; Manufacturer: HONOR; Supplier Part: C3344
C11 = RVT1V470M0605: Supplier: LCSC; Manufacturer: HONOR; Supplier Part: C3344; JLCPCB Part Class: Extended Part
CN2 = TE-350211-1-Simple: Supplier: Digi-Key; Supplier Part: AN1212-ND; Manufacturer: TE Connectivity; Manufacturer Part: 350211-1; Contributor: cdhooper; link: https://www.digikey.com/product-detail/en/te-connectivity-amp-connectors/350211-1/A1212-ND/30127
CN3 = FLOPPY PWR TE 171826-4: Manufacturer Part: 171826-4; Supplier Part: A112643-ND; Supplier: Digi-Key; Contributor: cdhooper; Manufacturer: TE Connectivity; link: https://www.te.com/usa-en/product-171826-4.html
CN4 = KF2510-3AGW_C722745: Supplier: LCSC; Supplier Part: C722745; Manufacturer: CAX(创都); Manufacturer Part: KF2510-3AGW; Contributor: LCSC; JLCPCB Part Class: Extended Part
D309A = LL4007G L0: Supplier: LCSC; Supplier Part: C283270; Manufacturer: ST(意法半导体); Manufacturer Part: TMBYV10-40FILM; Contributor: LCSC; JLCPCB Part Class: Extended Part
F309A = A72-185 POLYFUSE: Supplier: LCSC; Manufacturer: JDTFUSE; Manufacturer Part: A72-185; Contributor: LCSC; Supplier Part: C135432; JLCPCB Part Class: Extended Part
F309B = A72-185-POLYFUSE-SMD: Supplier: LCSC; Manufacturer: Brightking(君耀电子); Manufacturer Part: SMD2920B185TF; Contributor: LCSC; Supplier Part: C269182; JLCPCB Part Class: Extended Part
FID1-FID8 = FIDUCIAL_SQUARE_DOT_128_100: Part Number: Fid-Mark-Square; Manufacturer: *; Manufacturer Part Number: *; LatestRevisionDate: 2017-01-30; Pin Count: 1; Publisher: Nordic Semiconductor; Published: 2009-12-12; Note: *; Supplier part number: *; 2nd source Supplier: *; 2nd source part number: *; Artikkelnr Noca: N.A.; Footprint Doc: Fiducial; Artikkelnr Simpro: N.A.; ComponentLink1Description: Datasheet; ComponentLink1URL: *; ComponentLink2Description: Supplier link; ComponentLink2URL: *; HelpURL: *; Comment: Fiducial mark; Contributor: cdhooper
MB1 MB2 = Mousebites: Contributor: cdhooper
MH1-MH4 = MOUNTINGHOLE_4MM: Manufacturer Part: Mounting hole; Contributor: MrDFA
MK1 MK2 MK5-MK7 = Mounting_Hole: Contributor: KiCAD; license: https://www.gnu.org/licenses/lgpl-2.1.html
C350A C351A C400A C401A C403 = VZH4R7M1HTR-0406: Supplier: LCSC; Supplier Part: C445042; Manufacturer: Nichicon(尼吉康); Manufacturer Part: UWX1E4R7MCL1GB; Contributor: LCSC; JLCPCB Part Class: Extended Part
CN400 = Z-231012050106: Supplier: LCSC; Supplier Part: C221060; Manufacturer: Nextronics Engineering; Contributor: cdhooper; JLCPCB Part Class: Extended Part
U310 U311 U400 U401 = DS2107S: Manufacturer: Dallas; Contributor: cdhooper
C310A C310B C310C C310D C310E C310F C310G C310H C310I C310J C310K C310L C310M C310N C310O C310P C310Q C310R = CL31C101JHFNNNE: Supplier: LCSC; Supplier Part: C377018; Manufacturer: CCTC(三环); Manufacturer Part: TCC1206COG101J102ET; Contributor: LCSC; JLCPCB Part Class: Extended Part
CN309 = 300S-50P: Supplier: LCSC; Manufacturer: Ckmtw(灿科盟); Manufacturer Part: B-3000S50P-0110; Contributor: LCSC; Supplier Part: C146633; JLCPCB Part Class: Extended Part
CN310 = SCSI External MD50F: Contributor: cdhooper
FB310A FB310B FB310C FB310D FB310E FB310F FB310G FB310H FB310I FB310J FB310K FB310L FB310M FB310N FB310O FB310P FB310Q FB310R FB311A FB311B FB311C FB311D FB311E FB311F FB311G FB311H FB311I FB311J FB311K FB311L FB311M FB311N FB311O FB311P FB311Q FB311R = MLB3216-601(f): Supplier: LCSC; Manufacturer: FH; Manufacturer Part: CBG321609U600T; Supplier Part: C1020; JLCPCB Part Class: Extended Part; Supplier Part Alt: C74489
RP300A RP300B RP300C = SCSI Terminator sip-8: Contributor: cmacarthur; license: https://www.gnu.org/licenses/lgpl-2.1.html; Manufacturer Part: 4608X-104-331/221L; Supplier: Mouser; Supplier Part: 652-4608X104331/221L; Manufacturer: Bourns
SW1 = DA-08RP: Supplier: LCSC; Manufacturer: HRO; Supplier Part: C129027; JLCPCB Part Class: Extended Part
U213 = 74F244SCX: Supplier: LCSC; Manufacturer: TI; Supplier Part: C5555
C1 = Zorro III Edge: Contributor: cdhooper
C306B = CL21C100JBANNNC: Supplier: LCSC; Manufacturer: SAMSUNG; Supplier Part: C1785; JLCPCB Part Class: Basic Part
U100-U102 U105-U108 = 74FCT543TSO: Manufacturer: TI; Manufacturer Part: CY74FCT543TSOC; Contributor: cdhooper
U103 U109 = 74F245D: Supplier: LCSC; Manufacturer: PHILIPS; Supplier Part: C5557; JLCPCB Part Class: Extended Part
U200 U204 = 74F374D: Supplier: LCSC; Manufacturer: PHILIPS; Supplier Part: C5564
U201 = 74FCT521TSO: Manufacturer: Renesas Electronics; Manufacturer Part: 74FCT521CTSOG8; Supplier: Mouser; Supplier Part: 972-74FCT521CTSOG8; link: https://www.mouser.com/ProductDetail/972-74FCT521CTSOG8; Contributor: cdhooper
U307 = SN7407DR: Supplier: LCSC; Manufacturer: TI(德州仪器); Supplier Part: C40481; JLCPCB Part Class: Extended Part

## Nets
GND: C1.01(GND) C1.02(GND) C1.03(GND) C1.04(GND) C1.13(GND) C1.25(GND) C1.37(GND) C1.49(GND) C1.61(GND) C1.73(GND) C1.85(GND) C1.87(GND) C1.88(GND) C1.89(GND) C1.90(GND) C1.99(GND) C1.100(GND) C1A.1 C1B.2 C1C.2 C10.2 C11.2 C12.2 C13.2 C100A.2 C101A.2 C102A.2 C103A.2 C105A.2 C106A.1 C107A.2 C108A.2 C109A.2 C200A.1 C201A.2 C202A.2 C203A.2 C204A.1 C205A.2 C206A.1 C207A.2 C212A.2 C300A.2 C300B.2 C300C.2 C300D.1 C300E.2 C300F.2 C300G.2 C300H.1 C300I.2 C301A.1 C302A.2 C303A.1 C304A.2 C305A.2 C306A.2 C306B.2 C307A.1 C310A.1 C310B.1 C310C.1 C310D.1 C310E.1 C310F.1 C310G.1 C310H.1 C310I.1 C310J.2 C310K.2 C310L.2 C310M.2 C310N.2 C310O.2 C310P.2 C310Q.2 C310R.2 C350A.2 C350B.1 C351A.2 C351B.2 CN2.2 CN2.3 CN3.2(GND) CN3.3(GND) CN4.3 CN309.1 CN309.3 CN309.5 CN309.7 CN309.9 CN309.11 CN309.13 CN309.15 CN309.17 CN309.19 CN309.20 CN309.21 CN309.22 CN309.23 CN309.24 CN309.27 CN309.28 CN309.29 CN309.30 CN309.31 CN309.33 CN309.35 CN309.37 CN309.39 CN309.41 CN309.43 CN309.45 CN309.47 CN309.49 CN310.1(GND) CN310.2(GND) CN310.3(GND) CN310.4(GND) CN310.5(GND) CN310.6(GND) CN310.7(GND) CN310.8(GND) CN310.9(GND) CN310.10(GND) CN310.11(GND) CN310.15(GND) CN310.16(GND) CN310.17(GND) CN310.18(GND) CN310.19(GND) CN310.20(GND) CN310.21(GND) CN310.22(GND) CN310.23(GND) CN310.24(GND) CN310.25(GND) CN310.35(GND) CN310.36(GND) CN310.40(GND) CN310.42(GND) MH1.1 MH2.1 MH3.1 MH4.1 R109H.1 RP300A.1(COM1) RP300B.1(COM1) RP300C.1(COM1) SW1.9(PIN9) SW1.10(PIN10) SW1.11(PIN11) SW1.12(PIN12) SW1.13(PIN13) SW1.14(PIN14) SW1.15(PIN15) SW1.16(PIN16) U100.12(GND) U100.14(LEAB) U101.12(GND) U101.14(LEAB) U102.12(GND) U102.14(LEAB) U103.10(GND) U105.12(GND) U106.12(GND) U107.12(GND) U108.12(GND) U109.10(GND) U200.10(GND) U201.1(IA=B) U201.10(GND) U202.14(GND) U203.14(GND) U204.10(GND) U205.14(GND) U206.14(GND) U206.20(CE#) U207.14(GND) U213.10(GND) U300.2(Vss) U300.9(Vss) U300.15(Vss) U300.22(Vss) U300.31(Vss) U300.46(Vss) U300.54(Vss) U300.61(Vss) U300.69(Vss) U300.75(Vss) U300.82(Vss) U300.96(Vss) U300.109(Vss) U300.113(Vss) U300.118(Vss) U300.123(Vss) U300.128(Vss) U300.136(Vss) U300.143(Vss) U300.149(Vss) U300.156(Vss) U301.7(Gnd) U302.7(GND) U303.14(GND) U304.14(GND) U305.14(GND) U306.14(GND) U307.7(GND) U307.11(5A) U307.13(6A) U310.8(GND) U311.8(GND)
V5: C1.05(+5V) C1.06(+5V) C1A.2 C1B.1 C10.1 C11.1 C12.1 C13.1 C100A.1 C101A.1 C102A.1 C103A.1 C105A.1 C106A.2 C107A.1 C108A.1 C109A.1 C200A.2 C201A.1 C202A.1 C203A.1 C204A.2 C205A.1 C206A.2 C207A.1 C212A.1 C300A.1 C300B.1 C300C.1 C300D.2 C300E.1 C300F.1 C300G.1 C300H.2 C300I.1 C301A.2 C302A.1 C303A.2 C304A.1 C305A.1 C306A.1 C307A.2 CN2.4 CN3.1(5V) CN308.2 CN351.2 D309A.2(A) J100.1 R100A.2 R103A.2 R103B.2 R109A.2 R109B.2 R109C.2 R109D.2 R109E.2 R109F.2 R109G.2 R200A.2 R200B.2 R200C.2 R200D.2 R200E.2 R200F.2 R200G.2 R200H.2 R212A.1 R212B.2 R212C.2 R212D.2 R212E.1 R212F.1 R212G.1 R212H.1 R300A.2 R300B.1 R300C.2 R300D.1 R300E.2 R300F.2 R300G.2 R300H.2 R300I.2 R300J.2 R300K.2 R300L.2 R300M.1 R300N.2 R300O.2 R300P.2 R307A.2 R307B.1 RP300A.8(COM2) RP300B.8(COM2) RP300C.8(COM2) U100.24(VCC) U101.24(VCC) U102.24(VCC) U103.20(VCC) U105.24(VCC) U106.24(VCC) U107.24(VCC) U108.24(VCC) U109.20(VCC) U200.20(VCC) U201.20(VCC) U202.28(VCC) U203.28(VCC) U204.20(VCC) U205.28(VCC) U206.28(VCC) U207.28(VCC) U213.20(VCC) U300.6(Vdd) U300.19(Vdd) U300.39(Vdd) U300.40(HALT/-TIP/) U300.49(Vdd) U300.64(Vdd) U300.79(Vdd) U300.90(BIG_LIT/) U300.91(BS) U300.95(BOFF/) U300.99(Vdd) U300.139(Vdd) U300.153(Vdd) U301.14(Vcc) U302.1(RD0#) U302.4(SD0#) U302.10(SD1#) U302.11(CP1) U302.12(D1) U302.13(RD1#) U302.14(VCC) U303.28(VCC) U304.28(VCC) U305.28(VCC) U306.28(VCC) U307.14(VCC)
V12: C1.10(+12V) C1C.1 CN2.1 CN3.4(12V) CN4.2
A0: R300K.1 U300.144(A0) U304.26(IOQ) U305.16(I)
A1: R300L.1 U300.145(A1) U304.27(IOQ) U305.13(I)
A2: R300I.1 U103.7(A5) U202.7(I) U206.10(A0) U300.146(A2)
A3: R300J.1 U103.6(A4) U202.6(I) U206.9(A1) U300.147(A3)
A4: U103.5(A3) U202.5(I) U206.8(A2) U300.148(A4)
A5: U103.4(A2) U202.4(I) U206.7(A3) U300.150(A5)
A6: U103.3(A1) U202.3(I) U206.6(A4) U300.151(A6)
A7: U103.2(A0) U206.5(A5) U300.152(A7)
A8: U102.10(A7) U202.9(I) U206.4(A6) U300.154(A8)
A9: U102.9(A6) U206.3(A7) U300.155(A9)
A10: U102.8(A5) U206.25(A8) U300.157(A10)
A11: U102.7(A4) U206.24(A9) U300.158(A11)
A12: U102.6(A3) U206.21(A10) U300.159(A12)
A13: U102.5(A2) U206.23(A11) U300.160(A13)
A14: U102.4(A1) U206.2(A12) U300.1(A14)
A15: U102.3(A0) U206.26(A13) U300.3(A15)
A16: U101.10(A7) U206.27(A14) U300.4(A16)
A17: J100.3 U101.9(A6) U203.5(I) U300.5(A17)
A18: U101.8(A5) U203.4(I) U300.7(A18)
A19: U101.7(A4) U203.3(I) U300.8(A19)
A20: U101.6(A3) U300.10(A20)
A21: U101.5(A2) U300.11(A21)
A22: U101.4(A1) U300.12(A22)
A23: U101.3(A0) U203.2(CLK/I) U300.13(A23)
A24: U100.10(A7) U201.17(A7) U300.14(A24)
A25: U100.9(A6) U201.15(A6) U300.16(A25)
A26: U100.8(A5) U201.13(A5) U300.17(A26)
A27: U100.7(A4) U201.11(A4) U300.18(A27)
A28: U100.6(A3) U201.8(A3) U300.20(A28)
A29: U100.5(A2) U201.6(A2) U300.21(A29)
A30: U100.4(A1) U201.4(A1) U300.23(A30)
A31: U100.3(A0) U201.2(A0) U300.24(A31)
ABOEH: U100.2(OEBA) U100.13(OEAB) U101.2(OEBA) U101.13(OEAB) U102.2(OEBA) U102.13(OEAB) U205.27(IOQ) U306.10(I)
ABOEL: U103.19(OE#) U109.19(OE#) U205.26(IOQ)
BERR: R307B.2 U202.17(IOQ) U300.37(BERR/-TEA/) U303.10(I) U306.11(I) U307.6(3Y)
BGACK: R300A.1 U300.98(BGACK/-BB/)
BMASTER: U100.23(CEBA) U101.23(CEBA) U102.23(CEBA) U103.1(T/R#) U109.1(T/R#) U303.27(IOQ)
CBACK: R300B.2 U300.35(CBACK/-TBI/) U306.27(IOQ)
CBREQ: R300C.1 U300.33(CBREQ/-TT1/) U306.6(I)
CLK: R302B.1 U205.2(CLK/I) U207.2(CLK/I) U300.41(BCLK) U303.12(I) U305.2(CLK/I)
CLK_50M: R301A.1 U300.102(SCLK) U302.3(CP0)
CLKI: R302A.1 U302.2(D0) U304.2(CLK/I) U306.2(CLK/I)
D0: U107.10(A7) U204.18(D7) U204.19(Q7) U213.3(O4) U300.85(D0)
D1: U107.9(A6) U204.16(Q6) U204.17(D6) U213.5(O5) U300.84(D1)
D2: U107.8(A5) U204.14(D5) U204.15(Q5) U213.7(O6) U300.83(D2)
D2Z: U105.11(CEAB) U106.11(CEAB) U107.11(CEAB) U108.11(CEAB) U205.21(IOQ)
D3: U107.7(A4) U204.12(Q4) U204.13(D4) U213.9(O7) U300.81(D3)
D4: U107.6(A3) U204.8(D3) U204.9(Q3) U213.12(O3) U300.80(D4)
D5: U107.5(A2) U204.6(Q2) U204.7(D2) U213.14(O2) U300.78(D5)
D6: U107.4(A1) U204.4(D1) U204.5(Q1) U213.16(O1) U300.77(D6)
D7: U107.3(A0) U204.2(Q0) U204.3(D0) U213.18(O0) U300.76(D7)
D8: U106.10(A7) U300.73(D8)
D9: U106.9(A6) U300.72(D9)
D10: U106.8(A5) U300.71(D10)
D11: U106.7(A4) U300.70(D11)
D12: U106.6(A3) U206.11(D0) U300.68(D12)
D13: U106.5(A2) U206.12(D1) U300.67(D13)
D14: U106.4(A1) U206.13(D2) U300.66(D14)
D15: U106.3(A0) U206.15(D3) U300.65(D15)
D16: U108.3(A0) U300.62(D16)
D17: U108.4(A1) U300.60(D17)
D18: U108.5(A2) U300.59(D18)
D19: U108.6(A3) U300.58(D19)
D20: U108.7(A4) U300.57(D20)
D21: U108.8(A5) U300.56(D21)
D22: U108.9(A6) U300.55(D22)
D23: U108.10(A7) U300.53(D23)
D24: U105.3(A0) U200.18(D7) U300.51(D24)
D25: U105.4(A1) U200.17(D6) U300.50(D25)
D26: U105.5(A2) U200.14(D5) U300.48(D26)
D27: U105.6(A3) U200.13(D4) U300.47(D27)
D28: U105.7(A4) U200.8(D3) U206.16(D4) U300.45(D28)
D29: U105.8(A5) U200.7(D2) U206.17(D5) U300.44(D29)
D30: U105.9(A6) U200.4(D1) U206.18(D6) U300.43(D30)
D31: U105.10(A7) U200.3(D0) U206.19(D7) U300.42(D31)
DBLT: U105.1(LEBA) U105.14(LEAB) U106.1(LEBA) U106.14(LEAB) U107.1(LEBA) U107.14(LEAB) U108.1(LEBA) U108.14(LEAB) U205.24(IOQ)
DBOE: FB505.2 U105.2(OEBA) U105.13(OEAB) U106.2(OEBA) U106.13(OEAB) U107.2(OEBA) U107.13(OEAB) U108.2(OEBA) U108.13(OEAB)
DIP_EXT_TERM: R212G.2 SW1.7(PIN7) U213.4(I1) U310.16(PD#) U311.16(PD#)
DIP_LONG_SPINUP: R212E.2 SW1.5(PIN5) U213.8(I3)
DIP_SCSI_ADR0: R212A.2 SW1.1(PIN1) U213.17(I4)
DIP_SCSI_ADR1: R212B.1 SW1.2(PIN2) U213.15(I5)
DIP_SCSI_ADR2: R212C.1 SW1.3(PIN3) U213.13(I6)
DIP_SCSI_FAST: R212D.1 SW1.4(PIN4) U213.11(I7)
DIP_SCSI_LUNS: R212H.2 SW1.8(PIN8) U213.2(I0)
DIP_SYNCH_MODE: R212F.2 SW1.6(PIN6) U213.6(I2)
DP3_ABRT: R300P.1 U300.52(DP3_ABRT/)
IORST: R307A.1 U202.19(IOQ) U203.27(IOQ) U207.9(I) U300.94(RESET/) U303.11(I) U306.12(I) U307.8(4Y)
LED: R398.2 U307.2(1Y) U307.4(2Y)
LEDR: CN308.1 CN308.3 CN351.1 CN351.3 R398.1
M24: R200H.1 U200.19(Q7) U201.18(B7)
M25: R200G.1 U200.16(Q6) U201.16(B6)
M26: R200F.1 U200.15(Q5) U201.14(B5)
M27: R200E.1 U200.12(Q4) U201.12(B4)
M28: R200D.1 U200.9(Q3) U201.9(B3)
M29: R200C.1 U200.6(Q2) U201.7(B2)
M30: R200B.1 U200.5(Q1) U201.5(B1)
M31: R200A.1 U200.2(Q0) U201.3(B0)
MASTER: FB502.1 U100.11(CEAB) U101.11(CEAB) U102.11(CEAB) U205.18(IOQ) U303.3(I)
MATCH: U201.19(OA=B) U202.2(CLK/I)
NCR_INT: U207.10(I) U300.105(IRQ/)
PLD_AS: R300H.1 U300.25(AS/-TS/) U304.21(IOQ) U305.4(I)
PLD_ASQ: U305.20(IOQ) U306.13(I)
PLD_CFGLT: U200.11(CP) U202.23(IOQ)
PLD_DOE: R109H.2 U109.4(A2) U205.5(I) U304.10(I) U305.27(IOQ) U306.23(IOQ)
PLD_DS: R300G.1 U300.87(DS/-DLE) U304.20(IOQ)
PLD_DS0: R109A.1 U109.9(A7) U203.10(I) U207.6(I) U304.9(I) U305.23(IOQ)
PLD_DS1: R109B.1 U109.8(A6) U304.7(I) U305.24(IOQ)
PLD_DS2: R109C.1 U109.7(A5) U304.6(I) U305.25(IOQ)
PLD_DS3: R109D.1 U109.6(A4) U202.11(I) U304.5(I) U305.26(IOQ)
PLD_DTACK: U303.9(I) U304.11(I) U306.17(IOQ)
PLD_FC0: R109F.1 U109.3(A1) U202.16(I) U300.30(FC0-TM0)
PLD_FC1: R109G.1 U109.2(A0) U202.13(I) U300.29(FC1-TM1)
PLD_FC2: R103A.1 U103.8(A6) U203.11(I) U300.28(FC2-TM2)
PLD_FCS: FB500.2 U100.1(LEBA) U101.1(LEBA) U102.1(LEBA) U202.12(I) U203.12(I) U205.6(I) U207.12(I) U303.6(I) U306.4(I)
PLD_INT: U203.7(I) U207.26(IOQ)
PLD_INTREG: U203.24(IOQ) U204.11(CP) U205.11(I)
PLD_INTSPC: U202.27(IOQ) U203.16(I)
PLD_INTVEC: U203.23(IOQ) U204.1(OE#) U205.12(I) U207.11(I)
PLD_MTCR: R109E.1 U109.5(A3) U203.13(I) U205.17(IOQ) U305.10(I) U306.25(IOQ)
PLD_MYBUS: U205.4(I) U303.20(IOQ) U304.13(I) U305.3(I) U306.3(I)
PLD_NACK: U205.16(I) U207.24(IOQ)
PLD_NOZ3: U205.10(I) U305.9(I) U306.20(IOQ)
PLD_READ: FB506.1 R103B.1 U103.9(A7) U202.10(I) U203.9(I) U205.7(I) U207.7(I) U304.4(I) U305.5(I)
PLD_SCSI: U203.26(IOQ) U304.3(I) U306.7(I)
PLD_SID: U203.17(IOQ) U205.19(IOQ) U213.1(OE1#) U213.19(OE2#)
PLD_SIZ0: R300E.1 U300.27(SIZ0) U304.24(IOQ) U305.7(I)
PLD_SIZ1: R300F.1 U300.26(SIZ1) U304.25(IOQ) U305.6(I)
ROM_A15: J100.2 U206.1(VPP)
ROM_OE: U203.25(IOQ) U206.22(OE#) U207.19(IOQ)
SBG: U300.100(BG/) U303.21(IOQ)
SBR: FB503.2 U303.4(I)
SCDAT0: FB310K.1 FB311A.2 RP300B.5(R4) U300.131(SD0/) U311.3(R2)
SCDAT1: FB310L.1 FB311B.2 RP300B.6(R5) U300.130(SD1/) U311.4(R3)
SCDAT2: FB310M.1 FB311C.2 RP300B.7(R6) U300.129(SD2/) U311.5(R4)
SCDAT3: FB310N.1 FB311D.2 RP300A.7(R6) U300.127(SD3/) U311.6(R5)
SCDAT4: FB310O.1 FB311E.2 RP300A.6(R5) U300.126(SD4/) U310.5(R4)
SCDAT5: FB310P.1 FB311F.2 RP300A.5(R4) U300.125(SD5/) U311.10(R6)
SCDAT6: FB310Q.1 FB311G.2 RP300A.4(R3) U300.124(SD6/) U311.11(R7)
SCDAT7: FB310R.1 FB311H.2 RP300A.3(R2) U300.122(SD7/) U311.12(R8)
SCDATP: FB310J.1 FB311I.2 RP300A.2(R1) U300.121(SDP/) U311.13(R9)
SCSI_BUSY: CN309.36 FB311R.1 U307.1(1A) U307.3(2A)
SCSI_TERMPWR: CN309.26 CN310.38(TERM) F309A.2 F309B.2 U310.1(TPWR1) U310.9(TPWR2) U311.1(TPWR1) U311.9(TPWR2)
SCTRL_ACK: FB310G.1 FB311Q.2 RP300C.7(R6) U300.117(ACK/) U310.10(R6)
SCTRL_ATN: FB310I.1 FB311J.2 RP300C.6(R5) U300.120(ATN/) U310.6(R5)
SCTRL_BSY: FB310H.1 FB311R.2 RP300C.3(R2) U300.119(BSY/) U310.2(R1)
SCTRL_CD: FB310C.1 FB311M.2 RP300B.2(R1) U300.112(C/D) U311.2(R1)
SCTRL_IO: FB310A.1 FB311K.2 RP300B.3(R2) U300.110(I/O) U310.13(R9)
SCTRL_MSG: FB310E.1 FB311O.2 RP300B.4(R3) U300.115(MSG/) U310.12(R8)
SCTRL_REQ: FB310B.1 FB311L.2 RP300C.2(R1) U300.111(REQ/) U310.11(R7)
SCTRL_RST: FB310F.1 FB311P.2 RP300C.5(R4) U300.116(RST/) U310.4(R3)
SCTRL_SEL: FB310D.1 FB311N.2 RP300C.4(R3) U300.114(SEL/) U310.3(R2)
SLACK: U205.9(I) U300.92(SLACK/)
SREG: U300.93(CS/) U304.19(IOQ)
STERM: R300D.2 U300.36(STERM/-TA/) U304.12(I) U306.19(IOQ)
T_GND: C400A.2 C400B.1 C401A.2 C401B.1 C402.1 C403.2 CN400.1 CN400.3 CN400.5 CN400.7 CN400.9 CN400.11 CN400.13 CN400.15 CN400.17 CN400.19 CN400.20 CN400.21 CN400.22 CN400.23 CN400.24 CN400.27 CN400.28 CN400.29 CN400.30 CN400.31 CN400.33 CN400.34 CN400.35 CN400.37 CN400.39 CN400.41 CN400.43 CN400.45 CN400.47 CN400.49 U400.8(GND) U401.8(GND)
T_SCDAT0: CN400.2 U401.13(R9)
T_SCDAT1: CN400.4 U401.12(R8)
T_SCDAT2: CN400.6 U401.11(R7)
T_SCDAT3: CN400.8 U401.10(R6)
T_SCDAT4: CN400.10 U401.6(R5)
T_SCDAT5: CN400.12 U401.5(R4)
T_SCDAT6: CN400.14 U401.4(R3)
T_SCDAT7: CN400.16 U401.3(R2)
T_SCDATP: CN400.18 U401.2(R1)
T_SCSI_TERMPWR: C402.2 C403.1 CN400.26 U400.1(TPWR1) U400.9(TPWR2) U401.1(TPWR1) U401.9(TPWR2)
T_SCTRL_ACK: CN400.38 U400.11(R7)
T_SCTRL_ATN: CN400.32 U400.13(R9)
T_SCTRL_BSY: CN400.36 U400.12(R8)
T_SCTRL_CD: CN400.46 U400.4(R3)
T_SCTRL_IO: CN400.50 U400.2(R1)
T_SCTRL_MSG: CN400.42 U400.6(R5)
T_SCTRL_REQ: CN400.48 U400.3(R2)
T_SCTRL_RST: CN400.40 U400.10(R6)
T_SCTRL_SEL: CN400.44 U400.5(R4)
Z2D: FB504.2 U105.23(CEBA) U106.23(CEBA) U107.23(CEBA) U108.23(CEBA)
Z_7M: C1.92(7M Clock) U303.2(CLK/I)
Z_A2: C1.27(A2) U103.13(B5)
Z_A3: C1.26(A3) U103.14(B4)
Z_A4: C1.24(A4) U103.15(B3)
Z_A5: C1.21(A5) U103.16(B2)
Z_A6: C1.23(A6) U103.17(B1)
Z_A7: C1.28(A7) U103.18(B0)
Z_A8D0: C1.30(A8+D0,A8) U102.15(B7) U107.15(B7)
Z_A9D1: C1.32(A9+D1,A9) U102.16(B6) U107.16(B6)
Z_A10D2: C1.34(A10+D2,A10) U102.17(B5) U107.17(B5)
Z_A11D3: C1.36(A11+D3,A11) U102.18(B4) U107.18(B4)
Z_A12D4: C1.38(A12+D4,A12) U102.19(B3) U107.19(B3)
Z_A13D5: C1.39(A13+D5,A13) U102.20(B2) U107.20(B2)
Z_A14D6: C1.41(A14+D6,A14) U102.21(B1) U107.21(B1)
Z_A15D7: C1.43(A15+D7,A15) U102.22(B0) U107.22(B0)
Z_A16D8: C1.45(A16+D8,A16) U101.15(B7) U106.15(B7)
Z_A17D9: C1.47(A17+D9,A17) U101.16(B6) U106.16(B6)
Z_A18D10: C1.52(A18+D10,A18) U101.17(B5) U106.17(B5)
Z_A19D11: C1.54(A19+D11,A19) U101.18(B4) U106.18(B4)
Z_A20D12: C1.56(A20+D12,A20) U101.19(B3) U106.19(B3)
Z_A21D13: C1.58(A21+D13,A21) U101.20(B2) U106.20(B2)
Z_A22D14: C1.57(A22+D14,A22) U101.21(B1) U106.21(B1)
Z_A23D15: C1.59(A23+D15,A23) U101.22(B0) U106.22(B0)
Z_A24D24: C1.80(A24+D24,D8) U100.15(B7) U105.22(B0)
Z_A25D25: C1.78(A25+D25,D9) U100.16(B6) U105.21(B1)
Z_A26D26: C1.76(A26+D26,D10) U100.17(B5) U105.20(B2)
Z_A27D27: C1.71(A27+D27,D11) U100.18(B4) U105.19(B3)
Z_A28D28: C1.69(A28+D28,D12) U100.19(B3) U105.18(B4)
Z_A29D29: C1.67(A29+D29,D13) U100.20(B2) U105.17(B5)
Z_A30D30: C1.65(A30+D30,D14) U100.21(B1) U105.16(B6)
Z_A31D31: C1.63(A31+D31,D15) U100.22(B0) U105.15(B7)
Z_BERR: C1.46(/BERR) U307.5(3A)
Z_BGn: C1.64(/BGn) U303.5(I)
Z_BRn: C1.60(/BRn) U303.25(IOQ)
Z_CFGIN: C1.12(/CFGINn) U202.18(IOQ)
Z_CFGOUT: C1.11(/CFGOUTn) U200.1(OE#) U202.21(IOQ) U205.13(I) U207.16(I)
Z_CINH: C1.17(/CINH,/OVR) U202.24(IOQ)
Z_D16: C1.75(RSVD+D16,D0) U108.22(B0)
Z_D17: C1.77(RSVD+D17,D1) U108.21(B1)
Z_D18: C1.79(RSVD+D18,D2) U108.20(B2)
Z_D19: C1.81(RSVD+D19,D3) U108.19(B3)
Z_D20: C1.83(RSVD+D20,D4) U108.18(B4)
Z_D21: C1.86(RSVD+D21,D5) U108.17(B5)
Z_D22: C1.84(RSVD+D22,D6) U108.16(B6)
Z_D23: C1.82(RSVD+D23,D7) U108.15(B7)
Z_DOE: C1.93(DOE) U109.16(B2)
Z_DS0: C1.51(/DS0,/VMA) U109.11(B7)
Z_DS1: C1.98(/DS1,NC) U109.12(B6)
Z_DS2: C1.70(/DS2,/LDS) FB508.2
Z_DS3: C1.72(/DS3,/UDS) FB507.2
Z_DTACK: C1.66(/DTACK) C306B.1 U205.20(IOQ) U306.9(I)
Z_FC0: C1.31(FC0) U109.17(B1)
Z_FC1: C1.33(FC1) U109.18(B0)
Z_FC2: C1.35(FC2) U103.12(B6)
Z_FCS: C1.97(/FCS,NC) FB501.2 U305.21(IOQ)
Z_INT2: C1.19(/INT2) U207.27(IOQ)
Z_IORST: C1.94(/IORST,/BUSRST) U307.9(4A)
Z_LOCK: C1.29(/LOCK,A1) U203.6(I)
Z_MTACK: C1.48(/MTACK,/VPA) U306.5(I)
Z_MTCR: C1.18(/MTCR,XRDY) U109.15(B3)
Z_READ: C1.68(READ) U103.11(B7)
Z_SENSEZ3: C1.91(SenseZ3,GND) R100A.1 U202.20(IOQ)
Z_SLAVE: C1.09(/SLAVEn) U202.26(IOQ) U203.20(IOQ) U205.3(I) U207.13(I) U303.7(I)
Net-(C310A-2): C310A.2 CN310.50(IO) FB310A.2
Net-(C310B-2): C310B.2 CN310.49(REQ) FB310B.2
Net-(C310C-2): C310C.2 CN310.48(CD) FB310C.2
Net-(C310D-2): C310D.2 CN310.47(SEL) FB310D.2
Net-(C310E-2): C310E.2 CN310.46(MSG) FB310E.2
Net-(C310F-2): C310F.2 CN310.45(RST) FB310F.2
Net-(C310G-2): C310G.2 CN310.44(ACK) FB310G.2
Net-(C310H-2): C310H.2 CN310.43(BSY) FB310H.2
Net-(C310I-2): C310I.2 CN310.41(ATN) FB310I.2
Net-(C310J-1): C310J.1 CN310.34(DP) FB310J.2
Net-(C310K-1): C310K.1 CN310.26(D0) FB310K.2
Net-(C310L-1): C310L.1 CN310.27(D1) FB310L.2
Net-(C310M-1): C310M.1 CN310.28(D2) FB310M.2
Net-(C310N-1): C310N.1 CN310.29(D3) FB310N.2
Net-(C310O-1): C310O.1 CN310.30(D4) FB310O.2
Net-(C310P-1): C310P.1 CN310.31(D5) FB310P.2
Net-(C310Q-1): C310Q.1 CN310.32(D6) FB310Q.2
Net-(C310R-1): C310R.1 CN310.33(D7) FB310R.2
Net-(C350A-1): C350A.1 C350B.2 U310.7(VREF1) U310.15(VREF2)
Net-(C351A-1): C351A.1 C351B.1 U311.7(VREF1) U311.15(VREF2)
Net-(C400A-1): C400A.1 C400B.2 U400.7(VREF1) U400.15(VREF2)
Net-(C401A-1): C401A.1 C401B.2 U401.7(VREF1) U401.15(VREF2)
Net-(CN309-2): CN309.2 FB311A.1
Net-(CN309-4): CN309.4 FB311B.1
Net-(CN309-6): CN309.6 FB311C.1
Net-(CN309-8): CN309.8 FB311D.1
Net-(CN309-10): CN309.10 FB311E.1
Net-(CN309-12): CN309.12 FB311F.1
Net-(CN309-14): CN309.14 FB311G.1
Net-(CN309-16): CN309.16 FB311H.1
Net-(CN309-18): CN309.18 FB311I.1
Net-(CN309-32): CN309.32 FB311J.1
Net-(CN309-38): CN309.38 FB311Q.1
Net-(CN309-40): CN309.40 FB311P.1
Net-(CN309-42): CN309.42 FB311O.1
Net-(CN309-44): CN309.44 FB311N.1
Net-(CN309-46): CN309.46 FB311M.1
Net-(CN309-48): CN309.48 FB311L.1
Net-(CN309-50): CN309.50 FB311K.1
Net-(D309A-1): D309A.1(C) F309A.1 F309B.1
Net-(FB500-1): FB500.1 U305.19(IOQ)
Net-(FB501-1): FB501.1 U306.21(IOQ)
Net-(FB502-2): FB502.2 U300.38(MASTER/)
Net-(FB503-1): FB503.1 U300.101(BR/)
Net-(FB504-1): FB504.1 U205.23(IOQ)
Net-(FB505-1): FB505.1 U205.25(IOQ)
Net-(FB506-2): FB506.2 U300.32(R_W/)
Net-(FB507-1): FB507.1 U109.14(B4)
Net-(FB508-1): FB508.1 U109.13(B5)
Net-(R300M-2): R300M.2 U300.86(DP0)
Net-(R300N-1): R300N.1 U300.74(DP1)
Net-(R300O-1): R300O.1 U300.63(DP2)
Net-(R301A-2): R301A.2 U301.8(Out)
Net-(R302A-2): R302A.2 U302.6(Q0#)
Net-(R302B-2): R302B.2 U302.5(Q0)

Not connected (* = marked no-connect by the designer): C1 07(/OWN)* 08(-5V)* 14(/C3 Clock)* 15(CDAC Clock)* 16(/C1 Clock)* 20(-12V)* 22(/INT6)* 40(RSVD,/EINT7)* 42(RSVD,/EINT5)* 44(RSVD,/EINT4)* 50(E Clock)* 53(/RST)* 55(/HLT)* 62(/BGACK)* 74(/CCS,/AS)* 95(/BCLR,/GBG)* 96(RSVD,/EINT1)*; CN4 1*; CN309 25* 34; CN310 12(NC)* 13(NC)* 14(NC)* 37(RSVD)* 39(RSVD)*; CN400 25*; U202 1(NC)* 8(NC)* 15(NC)* 22(NC)* 25(IOQ)*; U203 1(NC)* 8(NC)* 15(NC)* 18(IOQ)* 19(IOQ)* 21(IOQ)* 22(NC)*; U205 1(NC)* 8(NC)* 15(NC)* 22(NC)*; U207 1(NC)* 3(I)* 4(I)* 5(I)* 8(NC)* 15(NC)* 17(IOQ)* 18(IOQ)* 20(IOQ)* 21(IOQ)* 22(NC)* 23(IOQ)* 25(IOQ)*; U300 34(UPS0-TT0/)* 88(SC0)* 89(SC1)* 97(FETCH/)* 103(TGS)* 104(IGS)* 106(SELDIR)* 107(RSTDIR)* 108(BSYDIR)* 132(SDIRP)* 133(SDIR7)* 134(SDIR6)* 135(SDIR5)* 137(SDIR4)* 138(SDIR3)* 140(SDIR2)* 141(SDIR1)* 142(SDIR0)*; U301 1(N.C)*; U302 8(Q1#)* 9(Q1)*; U303 1(NC)* 8(NC)* 13(I)* 15(NC)* 16(I)* 17(IOQ)* 18(IOQ)* 19(IOQ)* 22(NC)* 23(IOQ)* 24(IOQ)* 26(IOQ)*; U304 1(NC)* 8(NC)* 15(NC)* 16(I)* 17(IOQ)* 18(IOQ)* 22(NC)* 23(IOQ)*; U305 1(NC)* 8(NC)* 11(I)* 12(I)* 15(NC)* 17(IOQ)* 18(IOQ)* 22(NC)*; U306 1(NC)* 8(NC)* 15(NC)* 16(I)* 18(IOQ)* 22(NC)* 24(IOQ)* 26(IOQ)*; U307 10(5Y)* 12(6Y)*; U310 14(NC)*; U311 14(NC)*; U400 14(NC)* 16(PD#)*; U401 14(NC)* 16(PD#)*

## Notes on the sheets
sheet 1
- Commodore A4091
- Rev B Advanced SCSI II Controller Board
- This Zorro III board was originally designed and sold by Commodore, which did a single
  run of the Rev A design before shelving it. Commodore was running out of money at the
  time and didn't want to risk a second production run. The Rev B design was given to
  DKB Software for production, marketing, sales, distribution, and support.
- Features:
- Caveats:
- • Boot ROM
  • NCR 53C710 SCSI II controller
  • 50 pin internal connector
  • 50 pin external SCSI2 connector
  • 3.5" hard drive mounts on the card
  • Active SCSI termination
  • Zorro III bus support
- • Requires Buster 11
  • Does not work with with A3640 Rev 3.0
  • No RAM option
  • No wide SCSI support
- The Commodore A4091 was reverse-engineered by Stefan Reinauer and Chris Hooper.
- A4091
- Dave Haynie
- 1993
- SR
- 2021-11-09
- Overview
- ReA4091 Rev 4
- 2023-05-15
- CDH
- 2021-11-19
- 365120
- B4
- © 1993 Commodore Business Machines
- 1 of 8
sheet 2
- Internal 2x25 Connector
- Active Termination
- Commodore 391092-02 Ferrite Bead
  60 Ohm @ 100Mhz, 200mA 1206
- RSVD
- Open
- RSVD
- RSVD
- Open
- Male 180 IDC
- RSVD
- RSVD
- RSVD
- E
- B
- F
- External
- SCSI connector is
  HD50/MD50, like
  Sun Micro.
- RSVD
- DIP
- RSVD
- Switch
- External HD50 Connector
- RSVD
- EXT_TERM
- SYNCH_MODE
- LONG_SPINUP
- SCSI_FAST
- SCSI_ADR2
- SCSI_ADR1
- Buffer/driver 3-state
- SCSI_ADR0
- SCSI F.Bead  = CBM 391092-02
  100pF NPO    = CBM 390818-06
  SW1 8DIP HA  = CBM 390362-02
  HD50F SCSI-2 = CBM 391591-01
  74F244       = CBM 609208-12
  4.7uF 25V    = CBM 391097-06
  1K 1/8W 5%   = CBM 310026-07
- Optional
- Passive
- Termination
- A4091
- Dave Haynie
- 1993
- SR
- 2021-11-09
- SCSI
- CDH
- 2021-11-19
- 365120
- B4
- © 1993 Commodore Business Machines
- 2 of 8
sheet 3
- 32KB/64KB EPROM
- SCSI-2 Controller
- 74F74  = CBM 391320-01
  53C710 = CBM 391593-01
- A4091
- Dave Haynie
- 1993
- SR
- 2021-11-09
- NCR53C510
- CDH
- 2021-11-19
- 365120
- B4
- © 1993 Commodore Business Machines
- 3 of 8
sheet 4
- PLD Symbols
- The GAL/PAL devices on page 5 are programmed with gate configurations which consolidate what would be
  a large number of discrete components. Original Commodore source program files for the A4091 GAL
  components can be found on the Internet. The below can be used as a quick reference for symbols used
  in those programming files.
- A0 - SCSI sizing address
  A1 - SCSI sizing address _or_ A1/Lock signal
  A2 - Address A2
  A3 - Address A3
  A4 - Address A4
  A5 - Address A5
  A6 - Address A6
  A8 - Address A8 (known as A1 in U202)
  A17 - Address A17
  A18 - Address A18
  A19 - Address A19
  A23 - Address A23
  !ABOEL - Low order address transfer enable
  !ABOEH - High order address transfer enable
  !AS - SCSI address strobe
  !ASQ - Clocked/qualified version of SCSI AS*
- !D2Z - Data is transfered to Z3 bus
  DBLT - Data is latched
  !DCNT - State bit for Z3 stuff (internal)
  DMASTER - Master delayed
  !DBOE - Data transfer enable
  DOE - Z3 Data phase (data output enable)
  !DS0 - Z3 low order data strobe
  !DS1 - Z3 data strobe
  !DS2 - Z3 data strobe
  !DS3 - Z3 high order data strobe
  !DTACK - Z3 termination cycle
  !DTSYNC - Synchronizer for DTACK->STERM (internal)
  !DS - SCSI data strobe
  !EBG - Expansion bus grant
  !EBR - Z3 bus request
  !EDTACK - Z3 data acknowledge, on bus
  !EFCS - Z3 cycle strobe for DMA
- !MASTER - SCSI chip owns the A4091 bus
  !MATCH - Address comparator match
  !MTACK - Z3 slave burst strobe
  !MTCR - Z3 multiple transfer burst cycle strobe
  !MYBUS - The A4091 has the bus
  !NACK - Data acknowledge
  !NOZ3 - 1:Get off the Z3 bus (stop driving)
  !NS0 - ROM access counter (internal)
  !NS1 - ROM access counter (internal)
  !NS2 - ROM access counter (internal)
  !NS3 - ROM access counter (internal)
- READ - Z3 read strobe (signal/cycle)
  !REGED - A4091 is registered as Z3 master
  RCHNG - Registration is changing (internal)
  !ROM - System ROM access
  !RST - System reset
  !SBG - SCSI bus grant
  !SBR - SCSI bus request
  !SCSI - SCSI chip register address (see SREG)
  !SHUNT - Z2 configuration shunt (0=Z2 1=Z3)
  !SID - SCSI ID jumper access
  SIZ0 - SCSI transfer size
  SIZ1 - SCSI transfer size
  !SINT - SCSI interrupt
  !SLACK - NCR 53C710 slave acknowledge
  !SLAVE - Z3 slave select for interrupt cycles
  !SLAVEOE - Slave output enable
  SMASTER - Synched master for fall edge
  !SREG - SCSI chip register select (gated by clock)
  SSBR - Synched SCSI bus request
  !Z2D - Data is transfered from Z3 bus
  !SSYNC - SCSI address synchronizer (internal)
  !STERM - SCSI termination
- BA2 - SCSI burst address
  BA3 - SCSI burst address
  !BDTACK - Z3 data acknowledge, buffered
  !BERR - Z3 Bus error
  BFCS - 1:Buffered cycle strobe
  BFCS - 2:A4091 local Z3 cycle strobe
  BLOCKBG - after 1st SBG block till end
  BMASTER - Buffered/inverted version of MASTER
  C7M - Z3 arbiter clock
  !CBACK - SCSI burst acknowledge
  !CBREQ - SCSI burst request
  !CFGIN - Configuration chain input
  !CFGOUT - Configuration chain output
  CFGLT - Configuration address latch (on 0->1)
  !CINH - Z3 cache inhibit
  CLK - 1:25MHz NCR 53C710 bus clock
  !CLK - 2:25MHz system clock
  !CYCZ3 - On-bus Z3 cycle (internal)
- FC0 - CPU read/write function code
  FC1 - CPU read/write function code
  FC2 - CPU read/write function code
  FCS - Z3 full cycle strobe
  !INT - We generated an interrupt
  !INT2 - Zorro bus interrupt 2
  !INTASS - A vector has been assigned
  !INTPOLL - An interrupt polling phase is signaled
  INTREC - Interrupt register access
  !INTSERV - We're servicing this interrupt phase
  !INTSPC - Partially qualified interrupt space (decode)
  !INTVEC - An interrupt vector phase is signaled
- A4091
- Dave Haynie
- 1993
- SR
- 2021-11-09
- PLDs
- CDH
- 2021-11-19
- 365120
- B4
- © 1993 Commodore Business Machines
- 4 of 8
sheet 5
- I
- I
- I
- O
- O
- I
- O
- O
- I
- I
- I
- O
- O
- !DBOE
- I
- !DS3
- READ
- !SCSI
- !CLK
- SIZ1
- O
- CLK
- !INT2
- !INT
- I
- DOE
- !SLAVE
- CLK
- !ABOEL
- O
- I
- !DS2
- A1
- A0
- SIZ0
- O
- I
- !DS0
- !NACK
- O
- I
- FCS
- !MYBUS
- !ABOEH
- DBLT
- O
- I
- !DS1
- !SSYNC (NC)
- I
- READ
- !NS0 (NC)
- I
- READ
- !Z2D
- O
- I
- !AS
- O
- I
- !NS1 (NC)
- I
- !D2Z
- O
- I
- !DS0
- DOE
- !DS
- O
- I
- !RST
- !NS2 (NC)
- I
- !NOZ3
- !SLACK
- !DTACK
- IO
- I
- !DTACK
- !SREG
- O
- I
- !INTVEC
- !SINT
- !ROM
- I
- I
- INTREG
- !SID
- I
- !STERM
- !MYBUS
- (I) !A2
- (O) BA2
- (O) BA3
- FCS
- !SLAVE
- !CFGOUT
- !INTVEC
- !CFGOUT
- !NACK
- !MTCR
- !MASTER
- I
- I
- I
- I
- I
- I
- I
- I
- I
- I
- I
- I
- Note: U202.27 INTSPC
  is not listed as output
  in CPLD source.
- (NC) !NS3
- I
- I
- I
- I
- I
- O
- I
- I
- I
- O
- I
- I
- I
- O
- O
- !CYCZ3 (NC)
- A18
- A19
- A23
- !RST
- !ROM
- BFCS
- !CLK
- MTCR
- I
- A5
- A6
- !SLAVEOE (NC)
- I
- I
- A17
- INTREG
- !SCSI
- O
- O
- I
- I
- !MTACK
- !MYBUS
- !CBACK
- !DTSYNC (NC)
- O
- I
- A3
- A4
- !MATCH
- !CINH
- !SLAVE
- O
- I
- !INT
- A1
- !INTVEC
- O
- I
- !CBREQ
- !SCSI
- DOE
- O
- I
- A2
- !INTSPC (NC)
- CFGLT
- O
- !CFGOUT
- I
- READ
- !INTPOLL (NC)
- I
- !EDTACK
- !EFCS
- O
- I
- I
- A1[A8]
- !SHUNT
- O
- I
- !DS0
- IO
- I
- !ABOEH
- !NOZ3
- O
- I
- READ
- I
- I
- I
- FC2
- !SLAVE
- !INTSERV (NC)
- I
- !BERR
- !STERM
- O
- !DS3
- !RST
- FCS
- !MTCR
- !INTSPC
- !SID
- !INTASS
- !RST
- !ASQ
- !BDTACK
- FCS
- FC0
- !BERR
- !CFGIN
- I
- I
- I
- I
- I
- I
- I
- I
- O
- I
- I
- O
- (NC) !DCNT
- I
- I
- I
- I
- O
- I
- I
- I
- O
- !RCHNG (NC)
- From PLD equations
  -----------------------
  NC=Used Internally
     I=Input
    O=Output
   IO=Bidirectional
- !AS
- CLK
- DOE
- !DS2
- C7M
- !EBR
- I
- READ
- !MYBUS
- !DS1
- !DS3
- O
- I
- !EBG
- !SBR
- !MASTER
- O
- I
- I
- SIZ1
- !DS0
- O
- O
- I
- I
- FCS
- BMASTER
- !REGED (O)
- SSBR (O)
- SIZ0
- !SLAVE
- I
- !NOZ3
- !EFCS
- I
- I
- !DTACK
- !SBG
- O
- I
- !MTCR
- !ASQ
- O
- I
- !BERR
- !MYBUS
- O
- BFCS
- I
- !RST
- DMASTER (O)
- O
- MASTER
- A1
- A0
- CLK
- A4091
- I
- I
- I
- Dave Haynie
- 1993
- SR
- 2021-11-09
- PLDs
- CDH
- 2021-11-19
- 365120
- B4
- © 1993 Commodore Business Machines
- 5 of 8
- (O) SMASTER
- (O) BLOCKBG
sheet 6
- 8-bit Register w/ 3-state
- 8-bit Register w/ 3-state
- Latched Tranceiver
- Latched Tranceiver
- Latched Tranceiver
- Identity Comparator
- Latched Tranceiver
- Latched Tranceiver
- Latched Tranceiver
- Latched Tranceiver
- 7407     = CBM 391188-01
  74F245   = CBM 391375-01
  74FCT374 = CBM 390784-02
  74FCT543 = CBM 391487-01
- Optional
- Open collecter buffer
- Buffer/driver 3-state
- PCB Top
- Buffer/driver 3-state
- PCB Bottom
- A4091
- Dave Haynie
- 1993
- SR
- 2021-11-09
- Zorro
- CDH
- 2021-11-19
- 365120
- B4
- © 1993 Commodore Business Machines
- 6 of 8
sheet 7
- PLD bypass caps
- Bulk power
- Assembly fiducials
- Mechanical holes
- Fan Option
- Discrete IC bypass caps
- PCB Holes
- (bottom side)
- (top side)
- Board Separation Mousebites
- Drive Mounts
- Note: connector
  has non-standard
  pin numbering.
- Berg Drive Power
- MOLEX Drive Power
- SCSI termination power
- F309A DNI
- A4091
- Dave Haynie
- 1993
- SR
- 2021-11-09
- Power
- D309A 1N4001 (MELF) = CBM 391327-01
- CDH
- 2021-11-19
- 365120
- B4
- © 1993 Commodore Business Machines
- 7 of 8
sheet 8
- SCSI Active Terminator cut-out board
- B
- E
- F
- RSVD
- RSVD
- Open
- RSVD
- RSVD
- Male right angle IDC
- Board Holes
- Fiducials
- A4091
- Dave Haynie
- 1993
- SR
- 2021-11-09
- SCSI Terminator
- CDH
- 2021-11-19
- 365120
- B4
- © 1993 Commodore Business Machines
- 8 of 8
